# EAGLE design Sunflower_Rev1-3 (EAGLE 7.2.0)

## Sheet 1 of 3
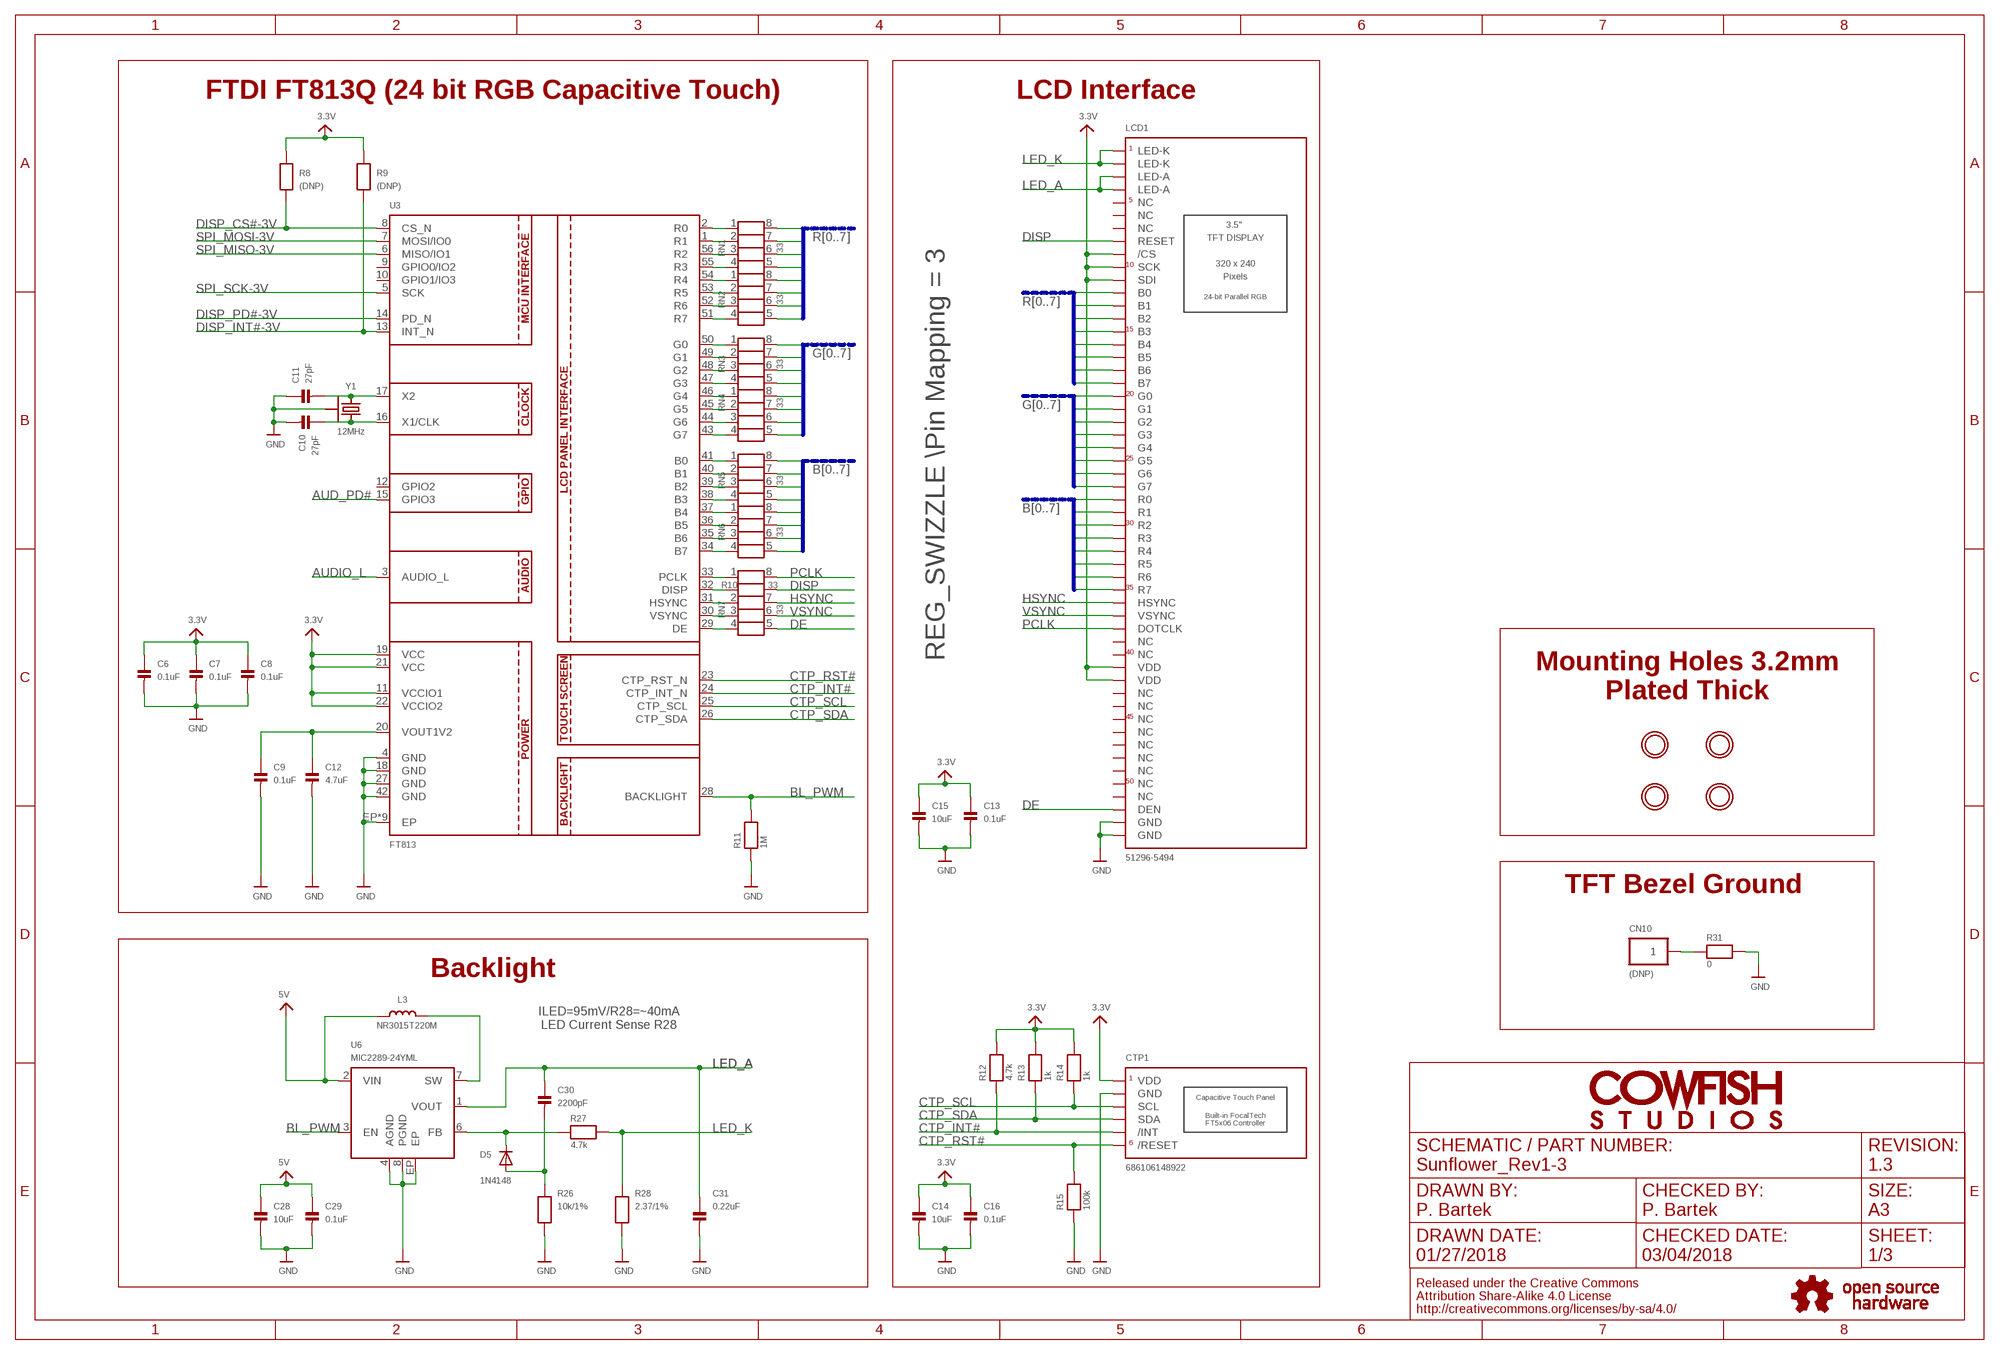
[diagram p0: schematic, sheet 1]

### Parts
C6  0.1uF  CAP_CERAMIC0603  [0603]
C7  0.1uF  CAP_CERAMIC0603  [0603]
C8  0.1uF  CAP_CERAMIC0603  [0603]
C9  0.1uF  CAP_CERAMIC0603  [0603]
C10  27pF  CAP_CERAMIC0603  [0603]
C11  27pF  CAP_CERAMIC0603  [0603]
C12  4.7uF  CAP_CERAMIC0603  [0603]
C13  0.1uF  CAP_CERAMIC0603  [0603]
C14  10uF  CAP_CERAMIC0603  [0603]
C15  10uF  CAP_CERAMIC0603  [0603]
C16  0.1uF  CAP_CERAMIC0603  [0603]
C28  10uF  CAP_CERAMIC0603  [0603]
C29  0.1uF  CAP_CERAMIC0603  [0603]
C30  2200pF  CAP_CERAMIC0603  [0603]
C31  0.22uF  CAP_CERAMIC0603  [0603]
CN10  (DNP)  RFI_SHIELD_FINGER  [S7081-42R]
CTP1  686106148922  CTPT4  [FPC_686106148922]
D5  1N4148  DIODESOD-323  [SOD-323]
H1  MOUNTINGHOLE3.2  [MOUNTINGHOLE_3.2_PLATED]
H2  MOUNTINGHOLE3.2  [MOUNTINGHOLE_3.2_PLATED]
H3  MOUNTINGHOLE3.2  [MOUNTINGHOLE_3.2_PLATED]
H4  MOUNTINGHOLE3.2  [MOUNTINGHOLE_3.2_PLATED]
L3  NR3015T220M  INDUCTOR  [INDUCTOR_3X3MM_TY_NR]
LCD1  51296-5494  TFT_NHD-3.5-320240MF-ASXNT1  [FPC_51296_5494]
R8  (DNP)  RESISTOR0603  [0603]
R9  (DNP)  RESISTOR0603  [0603]
R10  33  RESISTOR0603  [0603]
R11  1M  RESISTOR0603  [0603]
R12  4.7k  RESISTOR0603  [0603]
R13  1k  RESISTOR0603  [0603]
R14  1k  RESISTOR0603  [0603]
R15  100k  RESISTOR0603  [0603]
R26  10k/1%  RESISTOR0603  [0603]
R27  4.7k  RESISTOR0603  [0603]
R28  2.37/1%  RESISTOR0805  [0805]
R31  0  RESISTOR0603  [0603]
RN1  33  741-8_S  [741-8]
RN2  33  741-8_S  [741-8]
RN3  33  741-8_S  [741-8]
RN4  33  741-8_S  [741-8]
RN5  33  741-8_S  [741-8]
RN6  33  741-8_S  [741-8]
RN7  33  741-8_S  [741-8]
U3  FT813  [VQFN-56PIN]
U6  MIC2289-24YML  MIC2289  [MLF-8PIN]
Y1  12MHz  CRYSTALTHIN  [CRYSTAL_3.2X2.5]

### Nets
3.3V: C6.1 C7.1 C8.1 C13.1 C14.1 C15.1 C16.1 CTP1.1(VDD) LCD1.P$9(/CS) LCD1.P$10(SCK) LCD1.P$11(SDI) LCD1.P$41(VDD) LCD1.P$42(VDD) R8.2 R9.2 R12.2 R13.2 R14.2 U3.11(VCCIO1) U3.19(VCC) U3.21(VCC) U3.22(VCCIO2) ; also sheet 2
5V: C28.1 C29.1 L3.P$1 U6.2(VIN) ; also sheet 2,3
AUD_PD#: U3.15(GPIO3) ; also sheet 3
AUDIO_L: U3.3(AUDIO_L) ; also sheet 3
B0: LCD1.P$28(R0) RN5.8
B1: LCD1.P$29(R1) RN5.7
B2: LCD1.P$30(R2) RN5.6
B3: LCD1.P$31(R3) RN5.5
B4: LCD1.P$32(R4) RN6.8
B5: LCD1.P$33(R5) RN6.7
B6: LCD1.P$34(R6) RN6.6
B7: LCD1.P$35(R7) RN6.5
BL_PWM: R11.2 U3.28(BACKLIGHT) U6.3(EN)
CTP_INT#: CTP1.5(/INT) R12.1 U3.24(CTP_INT_N)
CTP_RST#: CTP1.6(/RESET) R15.2 U3.23(CTP_RST_N)
CTP_SCL: CTP1.3(SCL) R14.1 U3.25(CTP_SCL)
CTP_SDA: CTP1.4(SDA) R13.1 U3.26(CTP_SDA)
DE: LCD1.P$52(DEN) RN7.5
DISP: LCD1.P$8(RESET) R10.2
DISP_CS#-3V: R8.1 U3.8(CS_N) ; also sheet 2
DISP_INT#-3V: R9.1 U3.13(INT_N) ; also sheet 2
DISP_PD#-3V: U3.14(PD_N) ; also sheet 2
G0: LCD1.P$20(G0) RN3.8
G1: LCD1.P$21(G1) RN3.7
G2: LCD1.P$22(G2) RN3.6
G3: LCD1.P$23(G3) RN3.5
G4: LCD1.P$24(G4) RN4.8
G5: LCD1.P$25(G5) RN4.7
G6: LCD1.P$26(G6) RN4.6
G7: LCD1.P$27(G7) RN4.5
GND: C6.2 C7.2 C8.2 C9.2 C10.2 C11.1 C12.2 C13.2 C14.2 C15.2 C16.2 C28.2 C29.2 C31.2 CTP1.2(GND) CTP1.SUPPORT1(GND) CTP1.SUPPORT2(GND) LCD1.P$53(GND) LCD1.P$54(GND) LCD1.SUPPORT1(GND) LCD1.SUPPORT2(GND) R11.1 R15.1 R26.1 R28.1 R31.2 U3.4(GND) U3.18(GND) U3.27(GND) U3.42(GND) U3.EP U3.TV@1(EP) U3.TV@2(EP) U3.TV@3(EP) U3.TV@4(EP) U3.TV@5(EP) U3.TV@6(EP) U3.TV@7(EP) U3.TV@8(EP) U6.4(AGND) U6.8(PGND) U6.EP Y1.GND1 Y1.GND2 ; also sheet 2,3
HSYNC: LCD1.P$36(HSYNC) RN7.7
LED_A: C30.1 C31.1 LCD1.P$3(LED-A) LCD1.P$4(LED-A) U6.1(VOUT)
LED_K: LCD1.P$1(LED-K) LCD1.P$2(LED-K) R27.2 R28.2
N$1: RN1.1 U3.2(R0)
N$2: RN1.2 U3.1(R1)
N$3: RN1.3 U3.56(R2)
N$4: RN1.4 U3.55(R3)
N$5: RN2.1 U3.54(R4)
N$6: RN2.2 U3.53(R5)
N$7: RN2.3 U3.52(R6)
N$8: RN2.4 U3.51(R7)
N$9: RN3.1 U3.50(G0)
N$10: RN3.2 U3.49(G1)
N$11: RN3.3 U3.48(G2)
N$12: RN3.4 U3.47(G3)
N$13: RN4.1 U3.46(G4)
N$14: RN4.2 U3.45(G5)
N$15: RN4.3 U3.44(G6)
N$16: RN4.4 U3.43(G7)
N$17: RN5.1 U3.41(B0)
N$18: RN5.2 U3.40(B1)
N$19: RN5.3 U3.39(B2)
N$20: RN5.4 U3.38(B3)
N$21: RN6.1 U3.37(B4)
N$22: RN6.2 U3.36(B5)
N$23: RN6.3 U3.35(B6)
N$24: RN6.4 U3.34(B7)
N$25: RN7.1 U3.33(PCLK)
N$26: RN7.2 U3.31(HSYNC)
N$27: RN7.3 U3.30(VSYNC)
N$28: RN7.4 U3.29(DE)
N$29: CN10.P$1 R31.1
N$33: C11.2 U3.17(X2) Y1.2
N$34: C9.1 C12.1 U3.20(VOUT1V2)
N$35: C10.1 U3.16(X1/CLK) Y1.1
N$36: L3.P$2 U6.7(SW)
N$37: D5.C R27.1 U6.6(FB)
N$38: C30.2 D5.A R26.2
N$59: R10.1 U3.32(DISP)
PCLK: LCD1.P$38(DOTCLK) RN7.8
R0: LCD1.P$12(B0) RN1.8
R1: LCD1.P$13(B1) RN1.7
R2: LCD1.P$14(B2) RN1.6
R3: LCD1.P$15(B3) RN1.5
R4: LCD1.P$16(B4) RN2.8
R5: LCD1.P$17(B5) RN2.7
R6: LCD1.P$18(B6) RN2.6
R7: LCD1.P$19(B7) RN2.5
SPI_MISO-3V: U3.6(MISO/IO1) ; also sheet 2
SPI_MOSI-3V: U3.7(MOSI/IO0) ; also sheet 2
SPI_SCK-3V: U3.5(SCK) ; also sheet 2
VSYNC: LCD1.P$37(VSYNC) RN7.6
Unconnected: LCD1.P$5(NC) LCD1.P$6(NC) LCD1.P$7(NC) LCD1.P$39(NC) LCD1.P$40(NC) LCD1.P$43(NC) LCD1.P$44(NC) LCD1.P$45(NC) LCD1.P$46(NC) LCD1.P$47(NC) LCD1.P$48(NC) LCD1.P$49(NC) LCD1.P$50\(NC) LCD1.P$51(NC) U3.9(GPIO0/IO2) U3.10(GPIO1/IO3) U3.12(GPIO2)

### Buses
B[0..7]
G[0..7]
R[0..7]

### Notes on the sheet
- FTDI FT813Q (24 bit RGB Capacitive Touch) | LCD Interface
- RN1 | 33
- RN2 | 33
- RN3 | 33
- RN4 | 33
- RN5 | 33
- RN6 | 33
- RN7 | 33
- REG_SWIZZLE \Pin Mapping = 3
- Mounting Holes 3.2mm
  Plated Thick
- TFT Bezel Ground
- Backlight
- ILED=95mV/R28=~40mA
  LED Current Sense R28
- 1.3
- P. Bartek
- 01/27/2018 | 03/04/2018

## Sheet 2 of 3
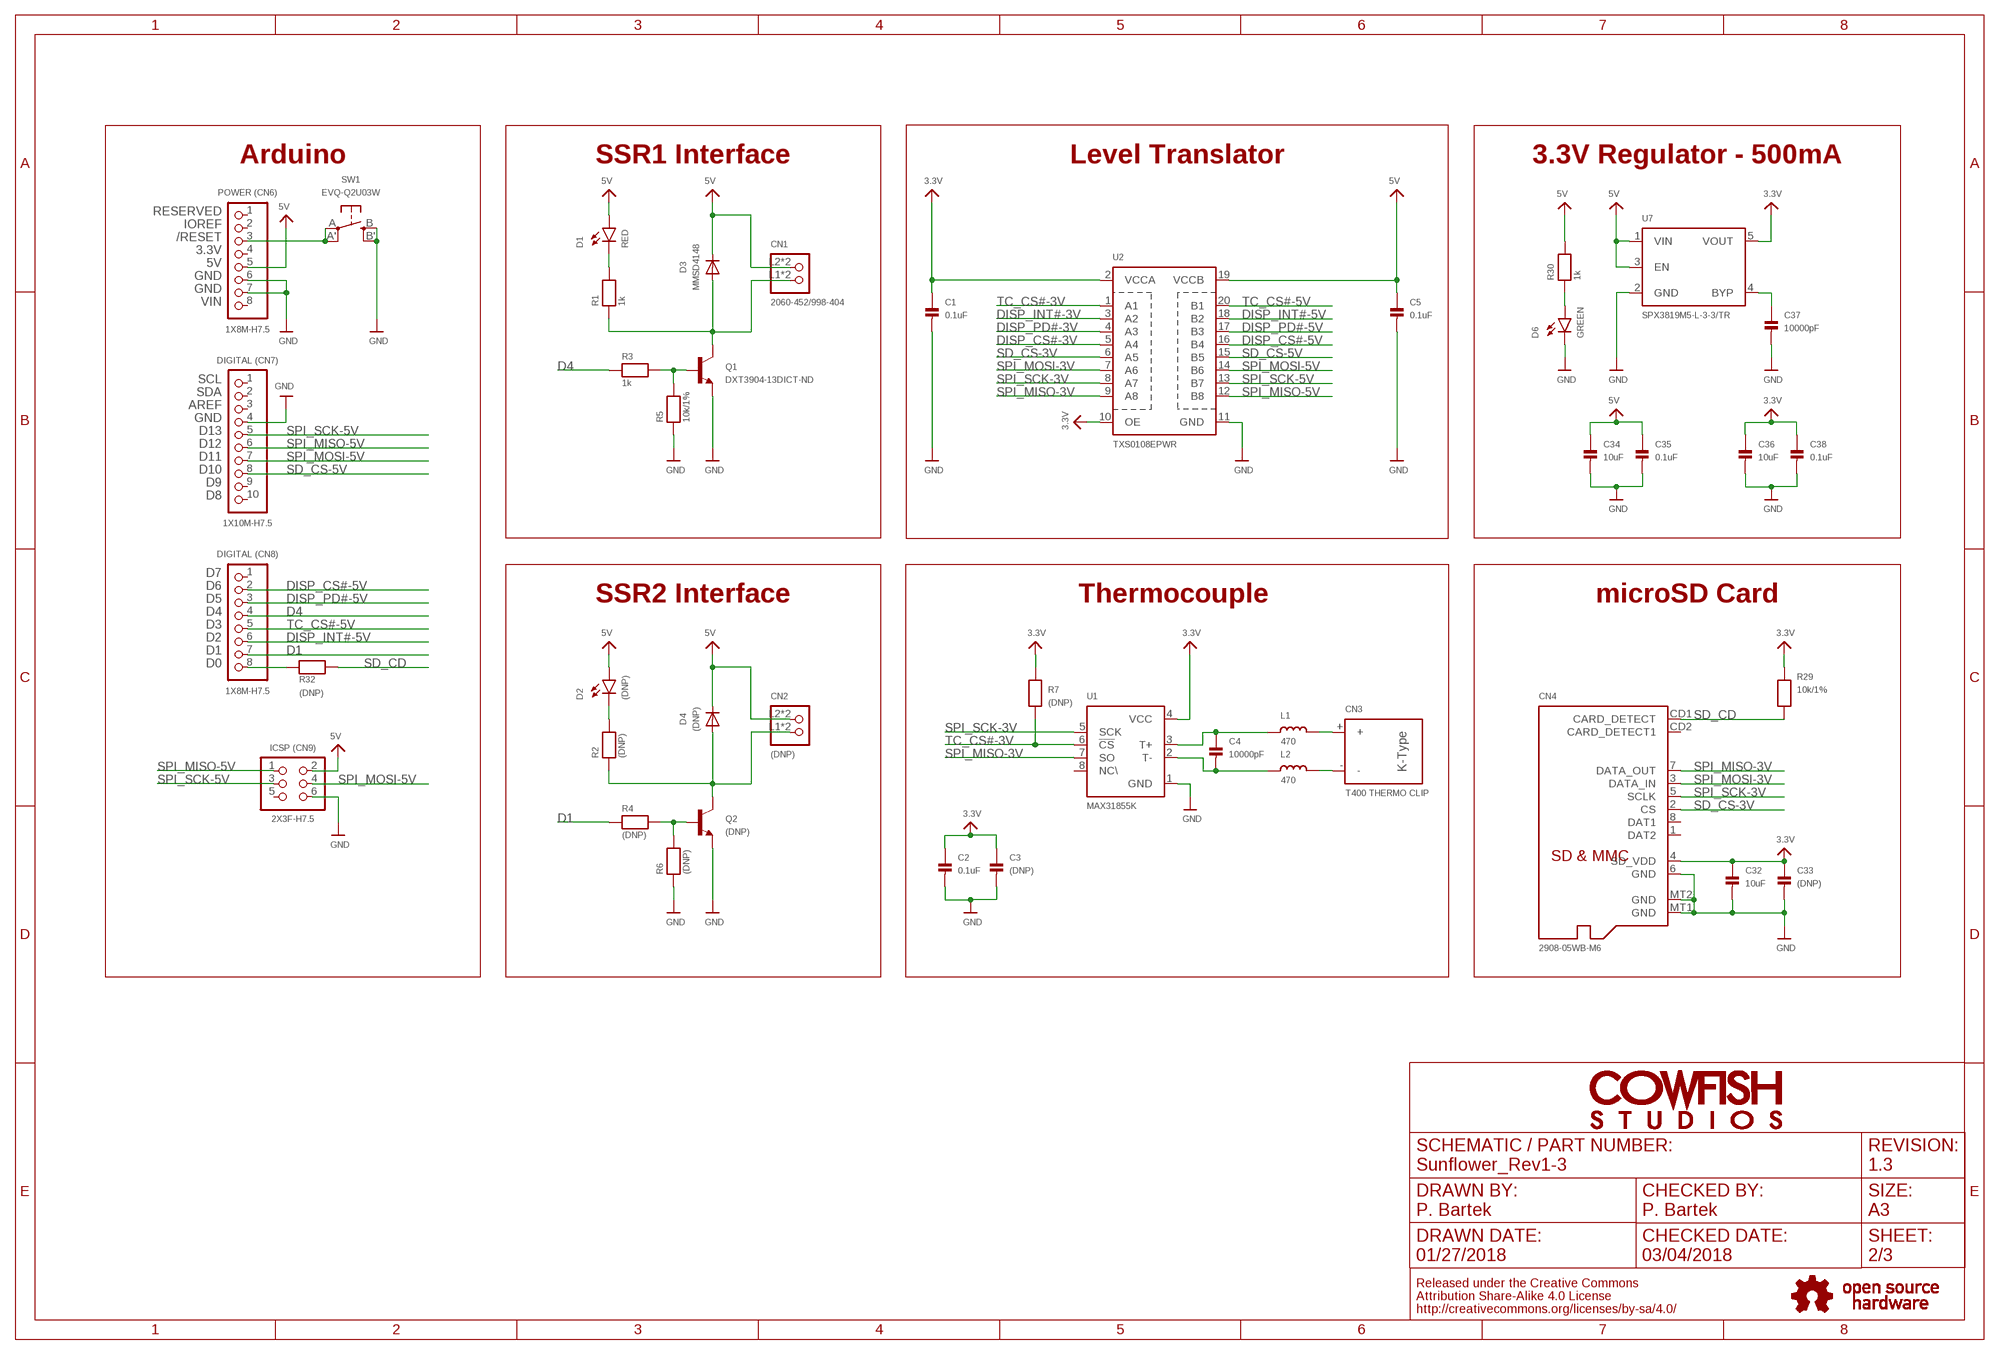
[diagram p1: schematic, sheet 2]

### Parts
C1  0.1uF  CAP_CERAMIC0603  [0603]
C2  0.1uF  CAP_CERAMIC0603  [0603]
C3  (DNP)  CAP_CERAMIC0603  [0603]
C4  10000pF  CAP_CERAMIC0603  [0603]
C5  0.1uF  CAP_CERAMIC0603  [0603]
C32  10uF  CAP_CERAMIC0603  [0603]
C33  (DNP)  CAP_CERAMIC0603  [0603]
C34  10uF  CAP_CERAMIC0603  [0603]
C35  0.1uF  CAP_CERAMIC0603  [0603]
C36  10uF  CAP_CERAMIC0603  [0603]
C37  10000pF  CAP_CERAMIC0603  [0603]
C38  0.1uF  CAP_CERAMIC0603  [0603]
CN1  2060-452/998-404  [P-2060-452/998-404]
CN2  (DNP)  2060-452/998-404  [P-2060-452/998-404]
CN3  T400 THERMO CLIP  THERMOCOUPLE_MINI_PAX_INSIDE  [THERMOCOUPLE_CLIP_INSIDE]
CN4  2908-05WB-M6  MICROSD  [MICROSD]
CN6  1X8M-H7.5  PINHD-1X08SMT_T1  [1X08_SMD_M_LEYCONN]
CN7  1X10M-H7.5  PINHD-1X10SMT_T1  [1X10_SMD_M_LEYCONN]
CN8  1X8M-H7.5  PINHD-1X08SMT_T1  [1X08_SMD_M_LEYCONN]
CN9  2X3F-H7.5  PINHD-2X03SMT_T2  [2X3_SMD_F_LEYCONN]
D1  RED  LED-BLUE0603  [LED-0603]
D2  (DNP)  LED-BLUE0603  [LED-0603]
D3  MMSD4148  DIODESOD-123  [SOD-123]
D4  (DNP)  DIODESOD-123  [SOD-123]
D6  GREEN  LED-BLUE0603  [LED-0603]
L1  470  INDUCTOR0603  [0603]
L2  470  INDUCTOR0603  [0603]
Q1  DXT3904-13DICT-ND  DXT3904-13  [SOT-89-3]
Q2  (DNP)  DXT3904-13  [SOT-89-3]
R1  1k  RESISTOR0603  [0603]
R2  (DNP)  RESISTOR0603  [0603]
R3  1k  RESISTOR0603  [0603]
R4  (DNP)  RESISTOR0603  [0603]
R5  10k/1%  RESISTOR0603  [0603]
R6  (DNP)  RESISTOR0603  [0603]
R7  (DNP)  RESISTOR0603  [0603]
R29  10k/1%  RESISTOR0603  [0603]
R30  1k  RESISTOR0603  [0603]
R32  (DNP)  RESISTOR0603  [0603]
SW1  EVQ-Q2U03W  SPST_TACT-EVQQ2  [EVQ-Q2]
U1  MAX31855K  [SOIC8]
U2  TXS0108EPWR  TXS0108ETSSOP  [TSSOP-20PIN]
U7  SPX3819M5-L-3-3/TR  SPX3819  [SOT23-5PIN]

### Nets
3.3V: C1.1 C2.1 C3.1 C32.1 C33.1 C36.1 C38.1 CN4.4(SD_VDD) R7.2 R29.2 U1.4(VCC) U2.2(VCCA) U2.10(OE) U7.5(VOUT) ; also sheet 1
5V: C5.1 C34.1 C35.1 CN1.L2(P1.1) CN1.L2.2(P1.1) CN2.L2(P1.1) CN2.L2.2(P1.1) CN6.5 CN9.2 D1.A D2.A D3.C D4.C R30.2 U2.19(VCCB) U7.1(VIN) U7.3(EN) ; also sheet 1,3
D1: CN8.7 R4.1
D4: CN8.4 R3.1
DISP_CS#-3V: U2.5(A4) ; also sheet 1
DISP_CS#-5V: CN8.2 U2.16(B4)
DISP_INT#-3V: U2.3(A2) ; also sheet 1
DISP_INT#-5V: CN8.6 U2.18(B2)
DISP_PD#-3V: U2.4(A3) ; also sheet 1
DISP_PD#-5V: CN8.3 U2.17(B3)
GND: C1.2 C2.2 C3.2 C5.2 C32.2 C33.2 C34.2 C35.2 C36.2 C37.2 C38.2 CN4.6(GND) CN4.MT1(GND) CN4.MT2(GND) CN6.6 CN6.7 CN7.4 CN9.6 D6.C Q1.E Q2.E R5.1 R6.1 SW1.B'(S1) SW1.B(S) U1.1(GND) U2.11(GND) U7.2(GND) ; also sheet 1,3
N$30: D6.A R30.1
N$39: C4.1 L1.1 U1.3(T+)
N$40: C4.2 L2.1 U1.2(T-)
N$41: CN3.+ L1.2
N$42: CN3.- L2.2
N$43: C37.1 U7.4(BYP)
N$45: Q1.B R3.2 R5.2
N$47: Q2.B R4.2 R6.2
N$48: CN1.L1(P2.1) CN1.L1.2(P2.1) D3.A Q1.C Q1.C@1(C) R1.1
N$49: D1.C R1.2
N$50: CN8.8 R32.1
N$51: D2.C R2.2
N$53: CN2.L1(P2.1) CN2.L1.2(P2.1) D4.A Q2.C Q2.C@1(C) R2.1
N$58: CN6.3 SW1.A'(P1) SW1.A(P)
SD_CD: CN4.CD1(CARD_DETECT) R29.1 R32.2
SD_CS-3V: CN4.2(CS) U2.6(A5)
SD_CS-5V: CN7.8 U2.15(B5)
SPI_MISO-3V: CN4.7(DATA_OUT) U1.7(SO) U2.9(A8) ; also sheet 1
SPI_MISO-5V: CN7.6 CN9.1 U2.12(B8)
SPI_MOSI-3V: CN4.3(DATA_IN) U2.7(A6) ; also sheet 1
SPI_MOSI-5V: CN7.7 CN9.4 U2.14(B6)
SPI_SCK-3V: CN4.5(SCLK) U1.5(SCK) U2.8(A7) ; also sheet 1
SPI_SCK-5V: CN7.5 CN9.3 U2.13(B7)
TC_CS#-3V: R7.1 U1.6(!CS) U2.1(A1)
TC_CS#-5V: CN8.5 U2.20(B1)
Unconnected: CN4.1(DAT2) CN4.8(DAT1) CN4.CD2(CARD_DETECT1) CN6.1 CN6.2 CN6.4 CN6.8 CN7.1 CN7.2 CN7.3 CN7.9 CN7.10 CN8.1 CN9.5 U1.8(NC\)

### Notes on the sheet
- Arduino | SSR1 Interface | Level Translator | 3.3V Regulator - 500mA
- POWER (CN6)
- RESERVED
- IOREF
- /RESET
- 3.3V
- 5V
- GND
- GND
- VIN
- DIGITAL (CN7)
- SCL
- SDA
- AREF
- GND
- D13
- D12
- D11
- D10
- D9
- D8
- DIGITAL (CN8)
- D7
- D6
- D5 | SSR2 Interface | Thermocouple | microSD Card
- D4
- D3
- D2
- D1
- D0
- ICSP (CN9)
- 1.3
- P. Bartek
- 01/27/2018 | 03/04/2018

## Sheet 3 of 3
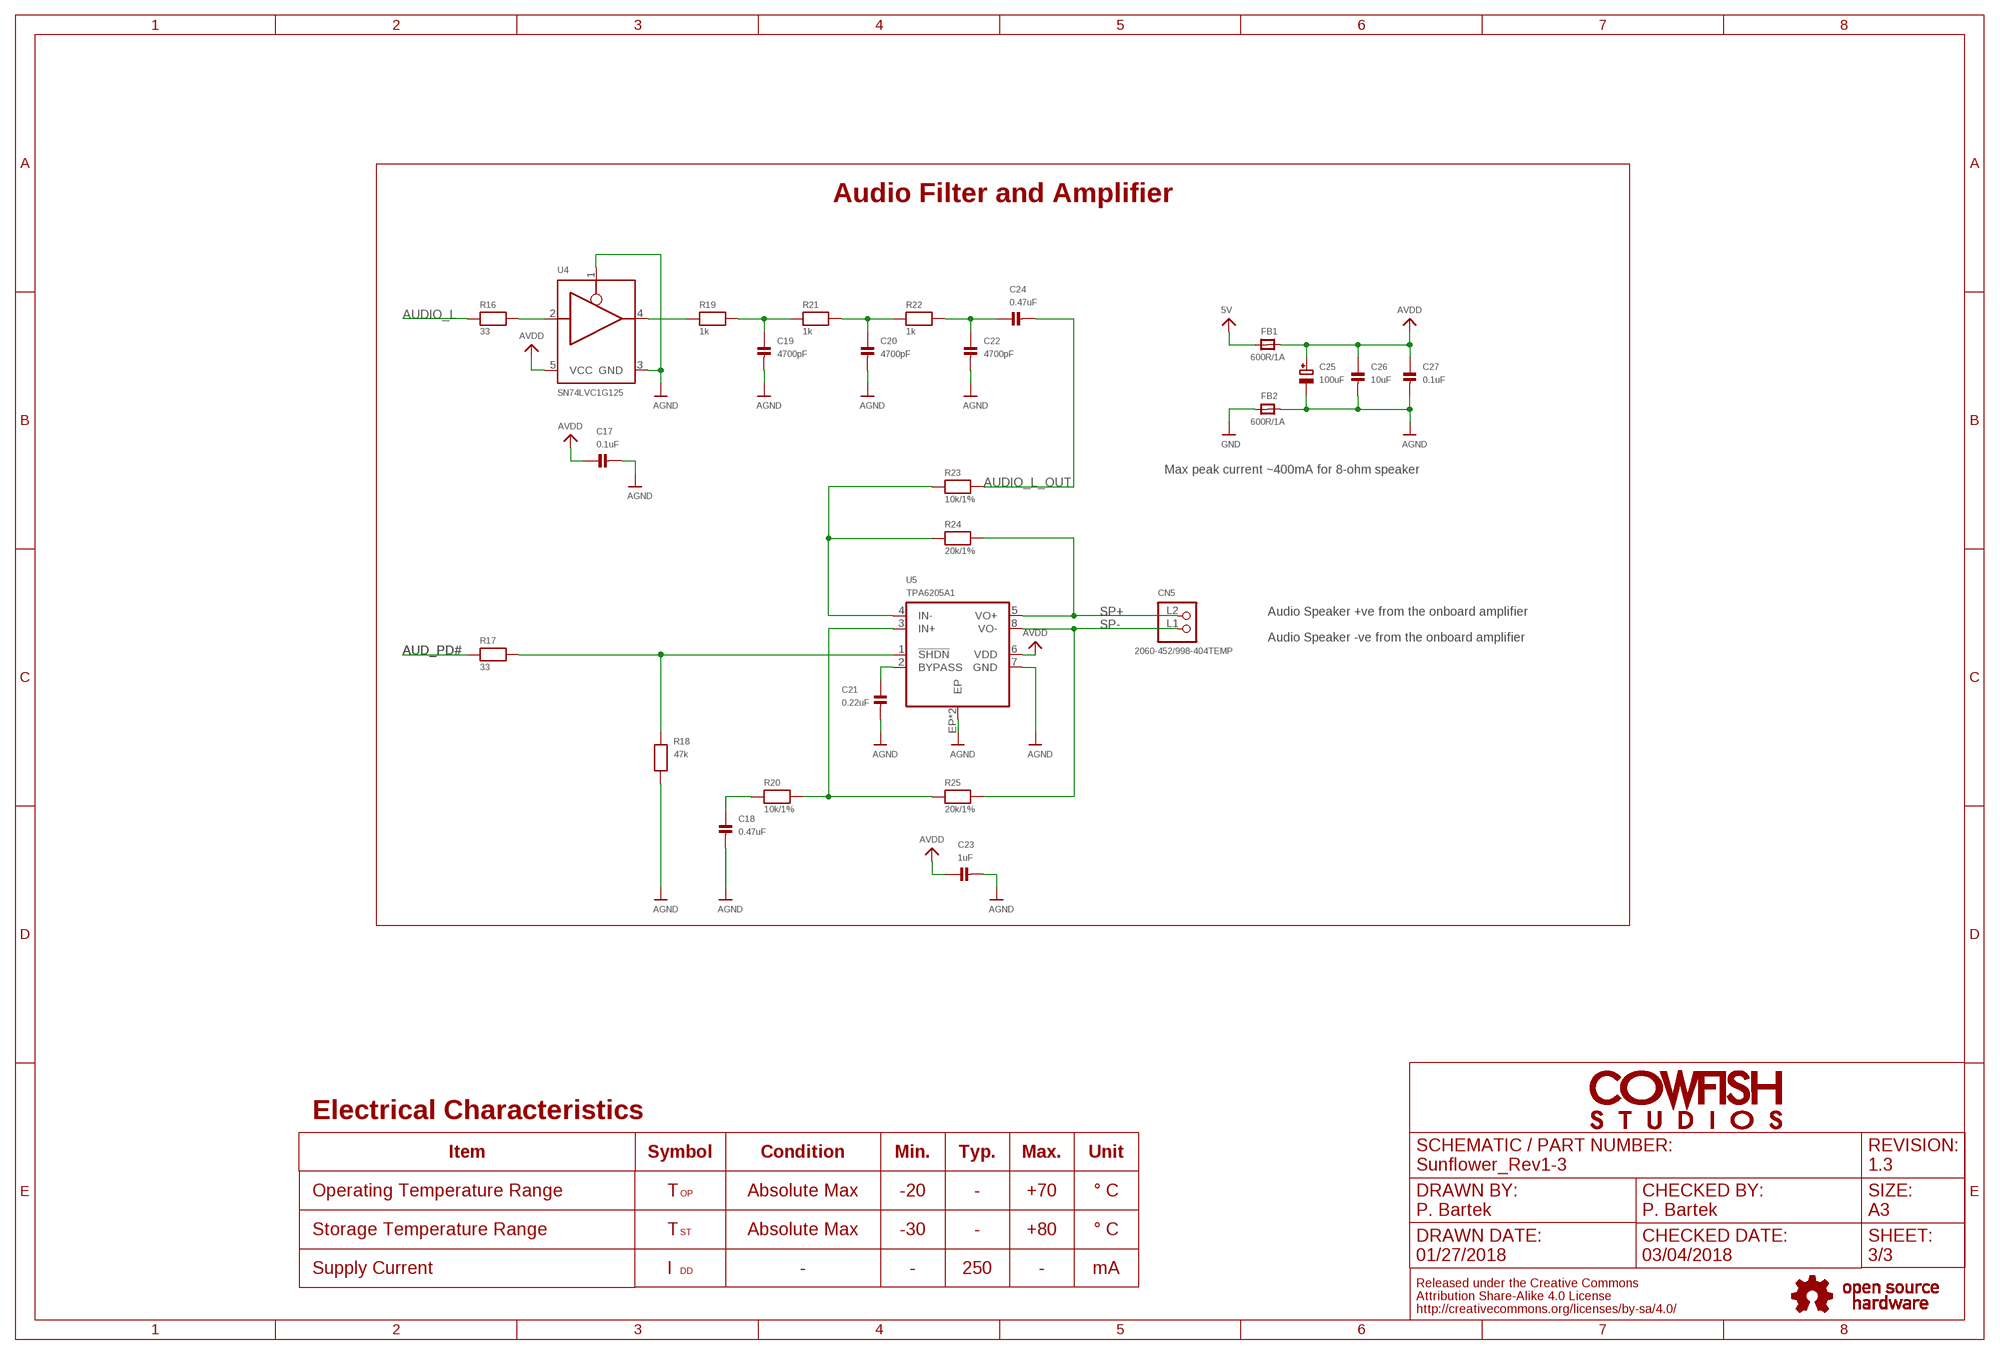
[diagram p2: schematic, sheet 3]

### Parts
C17  0.1uF  CAP_CERAMIC0603  [0603]
C18  0.47uF  CAP_CERAMIC0603  [0603]
C19  4700pF  CAP_CERAMIC0603  [0603]
C20  4700pF  CAP_CERAMIC0603  [0603]
C21  0.22uF  CAP_CERAMIC0805  [0805]
C22  4700pF  CAP_CERAMIC0603  [0603]
C23  1uF  CAP_CERAMIC0603  [0603]
C24  0.47uF  CAP_CERAMIC0603  [0603]
C25  100uF  CAP_TANTALUMA/3216_REFLOW  [EIA3216-18/A-R]
C26  10uF  CAP_CERAMIC0603  [0603]
C27  0.1uF  CAP_CERAMIC0603  [0603]
CN5  2060-452/998-404TEMP  [P-2060-452/998-404]
FB1  600R/1A  FERRITE0805  [0805]
FB2  600R/1A  FERRITE0805  [0805]
R16  33  RESISTOR0603  [0603]
R17  33  RESISTOR0603  [0603]
R18  47k  RESISTOR0603  [0603]
R19  1k  RESISTOR0603  [0603]
R20  10k/1%  RESISTOR0603  [0603]
R21  1k  RESISTOR0603  [0603]
R22  1k  RESISTOR0603  [0603]
R23  10k/1%  RESISTOR0603  [0603]
R24  20k/1%  RESISTOR0603  [0603]
R25  20k/1%  RESISTOR0603  [0603]
U4  SN74LVC1G125  [SOT23-5PIN]
U5  TPA6205A1  [MSOP-8PIN]

### Nets
5V: FB1.1 ; also sheet 1,2
AGND: C17.2 C18.2 C19.2 C20.2 C21.2 C22.2 C23.2 C25.- C26.2 C27.2 FB2.2 R18.1 U4.1(OE) U4.3(GND) U5.7(GND) U5.EP U5.TV(EP)
AUD_PD#: R17.1 ; also sheet 1
AUDIO_L: R16.1 ; also sheet 1
AUDIO_L_OUT: C24.2 R23.2
AVDD: C17.1 C23.1 C25.+ C26.1 C27.1 FB1.2 U4.5(VCC) U5.6(VDD)
GND: FB2.1 ; also sheet 1,2
N$32: R16.2 U4.2(I)
N$52: R17.2 R18.2 U5.1(!SHDN)
N$54: R19.1 U4.4(O)
N$55: C19.1 R19.2 R21.1
N$57: C20.1 R21.2 R22.1
N$60: C21.1 U5.2(BYPASS)
N$61: C22.1 C24.1 R22.2
N$65: R20.2 R25.1 U5.3(IN+)
N$66: C18.1 R20.1
N$71: R23.1 R24.1 U5.4(IN-)
SP+: CN5.L2(P1.1) R24.2 U5.5(VO+)
SP-: CN5.L1(P2.1) R25.2 U5.8(VO-)

### Notes on the sheet
- Audio Filter and Amplifier
- Max peak current ~400mA for 8-ohm speaker
- Audio Speaker +ve from the onboard amplifier
- Audio Speaker -ve from the onboard amplifier
- Electrical Characteristics
- Item | Symbol | Condition | Min. | Typ. | Max. | Unit
- 1.3
- Operating Temperature Range | T | OP | Absolute Max | -20 | - | +70 | ° C
- P. Bartek
- Storage Temperature Range | T | ST | Absolute Max | -30 | - | +80 | ° C
- 01/27/2018 | 03/04/2018
- Supply Current | I | DD | - | - | 250 | - | mA

## Library data of the parts
C1-C24 C26-C38 = microbuilder:CAP_CERAMIC: Ceramic Capacitors 0402 - 0402 Surface Mount Capacitors 16pF 50V 5% [Digikey: 445-4899-2-ND] 18pF 50V 5% [Digikey: 490-1281-2-ND] 22pF 50V 5% [Digikey: 490-1283-2-ND] 68pF 50V 5% [Digikey: 490-1289-2-ND] 0.1uF 10V 10% [Digikey: 490-1318-2-ND] 1.0uF 6.3V 10% [Digikey: 490-1320-2-ND] 0603 - 0603 Surface Mount Capacitors 16 pF 50V 5% [Digikey: 445-5051-2-ND] 22 pF 50V [Digikey: PCC220ACVTR-ND] 33 pF 50V 5% [Digikey: 490-1415-1-ND] 56pF 50V 5% [Digikey: 490-1421-1-ND] 220pF 50V 5% [Digikey: 445-1285-1-ND] 680 pF 50V 2200 pF 50V 5% C0G [Digikey: 445-1297-1-ND] 5600 pF 100V 5% X7R [Digikey: 478-3711-1-ND] 0.1 µF 25V 10% [Digikey: PCC2277TR-ND] 0.22 µF 16V 10% X7R [Digikey: 445-1318-1-ND] 1.0 µF 25V 10% [Digikey: 445-5146-2-ND] 0603 - RF Specific 3pF 250V +/-0.1pF RF [Digikey: 712-1347-1-ND] 18 pF 250V 5% [Digikey: 478-3505-1-ND or 712-1322-1-ND] 56 pF 250V 5% C0G RF [Digikey: 490-4867-1-ND] 68 pF 250V RF [Digikey: 490-4868-1-ND] 0805 - 0805 Surface Mount Capacitors 220 pF 250V 2% RF Ceramic Capacitor [Digikey: 712-1398-1-ND] 1000 pF 50V 2% NP0 Ceramic Capacitor [Digikey: 478-3760-1-ND] 0.1 µF 25V 10% Ceramic Capacitor [Digikey: PCC1828TR-ND] 1.0 µF 16V 10% Ceramic Capacitor[Digikey: 490-1691-2-ND] 10.0 µF 10V 10% Ceramic Capacitor[Digikey: 709-1228-1-ND] 10.0 uF 16V 10% Ceramic Capacitor [Digikey: 478-5165-2-ND] 47 uF 6.3V 20% Ceramic Capacitor [Digikey: 587-1779-1-ND or 399-5506-1-ND] 1206 - 1206 Surface Mount Capacitors 47uF 10V 20% Ceramic Capacitor [Digikey: 490-5528-1-ND or 399-5508-1-ND or 445-6010-1-ND] 100uF 6.3V -20%, +80% Y5V Ceramic Capacitor (Digikey: 490-4512-1-ND, Mouser: 81-GRM31CF50J107ZE1L)
C25 = microbuilder:CAP_TANTALUM: Tantalum Capacitors Wave footprints have larger pads and are meant to be used for hand soldering. Reflow footprints are optimised for solder paste and a reflow oven. EIA3216-18/A-[R/W] - Size A / 3216-18 / 1206 footprint 4.7µF 25V 10% Tantalum Capacitor 10µF 16V 10% Tantalum Capacitor [Digikey: 495-2236-2-ND] EIA3528-21/B-[R/W] - Size B / 3528-21 47µF 10V 10% Tantalum Capactior [Digikey: 495-2216-1-ND] EIA6032-28/C-[R/W] - Size C / 6032-28 10µF 35V 20% Tantalum Capacitor [Digikey: 495-2285-1-ND] 100µF 16V 10% Tantalum Capactior [Digikey: 399-5214-1-ND]
CN1 CN2 CN5 = CowFish-Connectors:2060-452/998-404: As of: 01/01/2014. Please find the newest data for this article in our product catalogue, which can be viewed under www.wago.com.
CN3 = CowFish-Connectors:THERMOCOUPLE_MINI_PAX; MF: Pax Instruments; MPN: PI1024 (2x)
CN4 = microbuilder:MICROSD: MicroSD/Transflash Card Holder with SPI pinout 3M: 2908-05WB-MG 4UConnector: 19656 Footprint courtesy: Adafruit Industries
CN6 CN8 = CowFish-Connectors:PINHD-1X08: Pin header 1x08 0.1" spacing
CN7 = CowFish-Connectors:PINHD-1X10: Pin header 1x10 0.1" spacing
CN9 = CowFish-Connectors:PINHD-2X03: Pin header 2x03 0.1" spacing
CN10 = CowFish-Connectors:RFI_SHIELD_FINGER
CTP1 = CowFish-Displays:CTP: Capacitive Touch Panel 6-Pin 1.0mm Pitch FPC Cable (Bottom Contacts)
D1 D2 D6 = SparkFun-LED:LED-BLUE: Blue SMD LED Used in manufacturing of various products at SparkFun Packages: 0603 - SMD 0603 package [Product Link] <http://www.digikey.com/product-detail/en/SMLE12BC7TT86/511-1589-2-ND/1641808> 1206 - SMD1206 package [Product Link] <http://www.digikey.com/product-detail/en/lite-on-inc/LTST-C150TBKT/160-1643-1-ND/573584> SparkFun Products: ESP8266 Thing-Dev Board <https://www.sparkfun.com/products/13711> RedBoard <https://www.sparkfun.com/products/12757>; PROD_ID: DIO-08575; VALUE: BLUE
D3-D5 = microbuilder:DIODE: Diode SMA Model Volts Amps Type Vf Vr Digikey # Notes SSA34-E3 40V 3A Schottky 480mV @ 3A 200uA @ 40V SSA34-E3/61TGITR-ND CDBA120-G 20V 1A Schottky 500mV @ 1A 500uA @ 20V 641-1014-6-ND REEL MBRA210 10V 2A Schottky 350mV @ 2A 700uA @ 10V MBRA210LT3 SOD-123 Model Volts Amps Type Vf Vr Order # Notes BAT54T1G 30V 200mA Schottky 800mV @ 200mA 2uA @ 25V BAT54T1GOSTR-ND B0530W 30V 500mA Schottky 430mV @ 500mA 130uA @ 30V B0530W-FDICT-ND REEL MBR120 1A 20V Schottky 340mV @ 1A MBR120VLSFT1GOSCT-ND SOD-323 Model Volts Amps Type Vf Vr Order # Notes PMEG2005EJ 20V 500mA Schottky 355mV @ 500mA 568-4110-1-ND ZLLS410 10V 570mA Schottky 380mV @ 570mA ZLLS410CT-ND 1N4148WS 75V 150mA Silicon/Simple 1V 1N4148WSFSCT-ND REEL SOD-523 Model Volts Amps Type Vf Vr Order # Notes BAT54XV2 30V 200mA Schottky 0.8V @ 100mA BAT54XV2CT-ND TB751S 30V 30mA Schottky RB751S-40TE61CT-ND SOT23-R/W (R = Solder Paste/Reflow Ovens, W = Hand-Soldering) Model Volts Amps Type Vf Vr Order # Notes BAT54FILM 40V 300mA Schottky 497-7162-1-ND
FB1 FB2 = microbuilder:FERRITE: Ferrite Bead 0603 MMZ1608B121C - 120 Ohm @ 100MHz, 600mA, 0.15 Ohm DC Resistance - Digikey: 445-2164-1-ND BK1608HW121-T - 120 Ohm, 600mA Ferrite Chip - Digikey: 587-1876-2-ND 0805 HZ0805B272R-10 - 2.7K Ohm @ 100MHz, 200mA, 0.8 Ohm DC Resistance - Digikey: 240-2504-1-ND (see also Murata BLM21BD272SN1L) MMZ2012Y152B - 1.5K Ohm @ 100MHz, 500mA, 0.4 Ohm DC Resistance - Digikey: 445-1560-1-ND - Mainly for high frequency (80-400MHz) MMZ2012R102A - 1K Ohm @ 100MHz, 500mA, 0.3 Ohm DC Resistance - Digikey: 445-1555-2-ND - More general purpose (10-200MHz)
H1-H4 = CowFish-Connectors:MOUNTINGHOLE: Mounting Hole
L1 L2 = microbuilder-old:INDUCTOR: Inductors 0603: 10nH Ceramic Inductor - microwire antenna/RF (Digikey: 712-1434-2-ND) 0805: 560nH Ceramic Inductor - RF (Digikey: 553-1047-1-ND) 270nH Ceramic Inductor - Q = 40@250MHz, +-5%, 1 Ohm DC Resistance (Digikey: 535-10506-2-ND) 1007 (2518 Metric) SMT: 10µH 10% 250mOhm 820mA 1007 Inductor (Digikey: 587-2189-1-ND) 22µH 10% 500mOhm 580mA 1007 Inductor (Digikey: 587-2190-1-ND) 47µH 10% 950mOhm 420mA 1007 Inductor (Digikey: 587-2191-1-ND) 47µH 5% 100mOhm 1A 1008 Inductor (Digikey: 732-1816-1-ND) 5.0x5.0mm (Taiyo Yuden NR5040 Series) 6.8µH 20% 2.3A 64mOhm Inductor (Digikey: 587-2374-2-ND) 5.0x5.0mm (TDK VLC5045 Series) 4.7µH 20% 3.3A 34mOhm Inductor (Digikey: 445-6526-1-ND) 6.8µH 20% 2.7A 46mOhm Inductor (Digikey: 445-6527-1-ND) 6.0x6.0mm (TDK VLC6045 Series) 4.7µH 20% 3.8A 27mOhm Inductor (Digikey: 445-6538-2-ND) 6.8µH 20% 3A 41mOhm Inductor (Digikey: 445-6540-1-ND) 6.2µH 30% 2.2A 45mOhm Inductor (Digikey: SRR5028-6R2YCT-ND) - Not TDK VLC6045 but footprint should match 6.0x6.0mm (TDK SLF6045 Series) 6.8uH 30% 2A 33mOhm Inductor (Digikey: 445-4572-1-ND, Mouser: 810-SLF645T6R8N2R0PF)
L3 = CowFish-Passives:INDUCTOR
LCD1 = CowFish-Displays:TFT_NHD-3.5-320240MF-ASXN: 3.5" 320x240 24-bit Parallel RGB - NHD-3.5-320240MF-ASXN# 54-Pin 0.5mm FPC (Bottom Contact)
Q1 Q2 = CowFish-Passives:DXT3904-13: TRANS NPN 40V 0.2A SOT89-3 Bipolar (BJT) Transistor NPN 40V 200mA 300MHz 1W Surface Mount SOT-89-3 - Digikey: DXT3904-13DICT-ND
R1-R32 = microbuilder:RESISTOR: Resistors 0402 - 0402 Surface Mount Package 22 Ohm 1% 1/16W [Digikey: 311-22.0LRTR-ND] 33 Ohm 5% 1/16W 1.0K 5% 1/16W 1.5K 5% 1/16W 2.0K 1% 1/16W 10.0K 1% 1/16W [Digikey: 311-10.0KLRTR-ND] 10.0K 5% 1/16W [Digikey: RMCF0402JT10K0TR-ND] 12.1K 1% 1/16W [Digikey: 311-22.0LRTR-ND] 100.0K 5% 1/16W 0603 - 0603 Surface Mount Package 0 Ohm 1/10 Watt 1% Resistor 15 Ohm 1/10 Watt 1% Resistor 33 Ohm 1/10 Watt 1% Resistor 49.9 Ohm 1/10 Watt 1% Resistor 100 Ohm 1/10 Watt 1% Resistor 150 Ohm 1/10 Watt 1% Resistor 240 Ohm 1/10 Watt 1% Resistor 390 Ohm 1/10 Watt 1% Resistor 560 Ohm 1/10 Watt 1% Resistor 680 Ohm 1/10 Watt 1% Resistor 750 Ohm 1/10 Watt 1% Resistor 1.0K Ohm 1/10 Watt 1% Resistor 1.5K Ohm 1/10 Watt 1% Resistor 2.0K Ohm 1/10 Watt 1% Resistor 2.2K Ohm 1/10 Watt 1% Resistor 3.3K Ohm 1/10 Watt 1% Resistor 4.7K Ohm 1/10 Watt 1% Resistor 10.0K Ohm 1/10 Watt 1% Resistor 12.0K Ohm 1/10 Watt 1% Resistor 12.1K Ohm 1/10 Watt 1% Resistor 20.0K Ohm 1/10 Watt 1% Resistor 33.0K Ohm 1/10 Watt 1% Resistor 100.0K Ohm 1/10 Watt 1% Resistor 0805 - 0805 Surface Mount Package 0 Ohm 1/8 Watt 1% Resistor 33 Ohm 1/8 Watt 1% Resistor 100 Ohm 1/8 Watt 1% Resistor 150 Ohm 1/8 Watt 1% Resistor 200 Ohm 1/8 Watt 1% Resistor 240 Ohm 1/8 Watt 1% Resistor 330 Ohm 1/8 Watt 1% Resistor 390 Ohm 1/8 Watt 1% Resistor 470 Ohm 1/8 Watt 1% Resistor 1.0K Ohm 1/8 Watt 1% Resistor 1.5K Ohm 1/8 Watt 1% Resistor 2.0K Ohm 1/8 Watt 1% Resistor 4.7K Ohm 1/8 Watt 1% Resistor 5.1K Ohm 1/8 Watt 1% Resistor 5.6K Ohm 1/8 Watt 1% Resistor 10.0K Ohm 1/8 Watt 1% Resistor 22.0K Ohm 1/8 Watt 1% Resistor 33.0K Ohm 1/8 Watt 1% Resistor 100K Ohm 1/8 Watt 1% Resistor 1206 - 1206 Surface Mount Package 2012 - 2010 Surface Mount Package 0.11 Ohm 1/2 Watt 1% Resistor - Digikey: RHM.11UCT-ND
RN1-RN7 = CowFish-Passives:741-8_S: CTS 741 Series 8 Terminations, 4 Resistors
SW1 = CowFish-Switches:SPST_TACT: SMT 6mm switch, EVQQ2 series
U1 = CowFish-IC:MAX31855K: Cold-Junction-Compensated K-Thermocoupleto-Digital Converter (-270°C to +1800°C) The MAX31855K performs cold-junction compensation and digitizes the signal from a type-K thermocouple. The data is output in a 14-bit resolution, SPI™-compatible, read-only format. This converter resolves temperatures to 0.25°C, allows readings as high as +1800°C and as low as -270°C, and exhibits thermocouple accuracy of ±2°C for temperatures ranging from -200°C to +700°C for K-type thermocouples.
U2 = CowFish-IC:TXS0108E: TXS0108E - IC Voltage Level Translator Bidirectional 1 Circuit 8 Channel 60Mbps Digikey: 296-24806-1-ND - 20-VQFN Digikey: 296-23011-1-ND - 20-TSSOP
U3 = CowFish-IC:FT813: FT813Q - IC TFT LCD CONTROLLER 56VQFN
U4 = CowFish-IC:SN74LVC1G125: SN74LVC1G125 - IC BUS BUFF TRI-ST N-INV SC705 Digikey: 296-11604-1-ND
U5 = CowFish-IC:TPA6205A1: TPA6205A1 - IC AMP AUDIO PWR 1.25W AB 8MSOP Digikey: 296-21262-1-ND
U6 = CowFish-IC:MIC2289: MIC2289 - IC LED Driver DC DC Regulator Analog, PWM Dimming 750mA (Switch) Backlight 8-MLF (2x2) Digikey: 576-1732-1-ND - 34 output OVP Digikey: 576-1731-1-ND - 24 output OVP
U7 = CowFish-IC:SPX3819: SPX3819 - PMIC - Voltage Regulator SOT-23-5 Digikey: 1016-1873-1-ND
Y1 = microbuilder:CRYSTAL: Crystals HC49UP - Surface Mount Crystal 4.0MHz 18pF +/-30ppm Surface Mount Crystal [Digikey: 535-9857-1-ND] 12.0 MHz Surface Mount Crystal [Digikey: 535-9869-6-ND] 25.0 MHz Surface Mount Crystal [Digikey: 535-9078-1-ND] 2.5 x 2.0mm - MEMs SMT Crystal 16.0 MHz 10pF 20ppm 2.5 x 2.0mm Crystal [Digikey -40-85°C: 535-10923-1-ND] 3.2 x 2.5mm - MEMs SMT Crystal 12.0 MHz 8pF 15ppm 3.2 x 2.5mm Crystal [Digikey: -10-70°C: 644-1047-1-ND -40-125°C: 644-1128-1-ND] 16.0 MHz 8pF 15ppm 3.2 x 2.5mm Crystal [Digikey: -10-70°C: 644-1049-1-ND -40-125°C: 644-1129-2-ND] 16.0 MHz 10pF 10ppm 3.2 x 2.5mm Crystal [Digikey: 644-1100-1-ND] 27.12 MHz 18pF 30ppm 3.2 x 2.5mm Crystal [Digikey: 887-1424-1-ND] 27.12MHz 10pF 10ppm 3.2 x 2.5mm Crystal [Digikey: 887-1329-1-ND] 4.9 x 1.8mm - MEMs SMT Crystal 32.768 KHz 12.5pF 20ppm 4.9 x 1.8mm Crystal [Digikey: SE2415CT-ND] 8.0 x 3.8mm - Surface Mount Crystal 32.768kHz 12.5pF 20ppm -40°C-85°C [Digikey: 535-9166-2-ND] Cylinder 32.768KHz Cylinder Crystal (2x6mm body) [Ex. Digikey: 300-8341-2-ND]

## Board
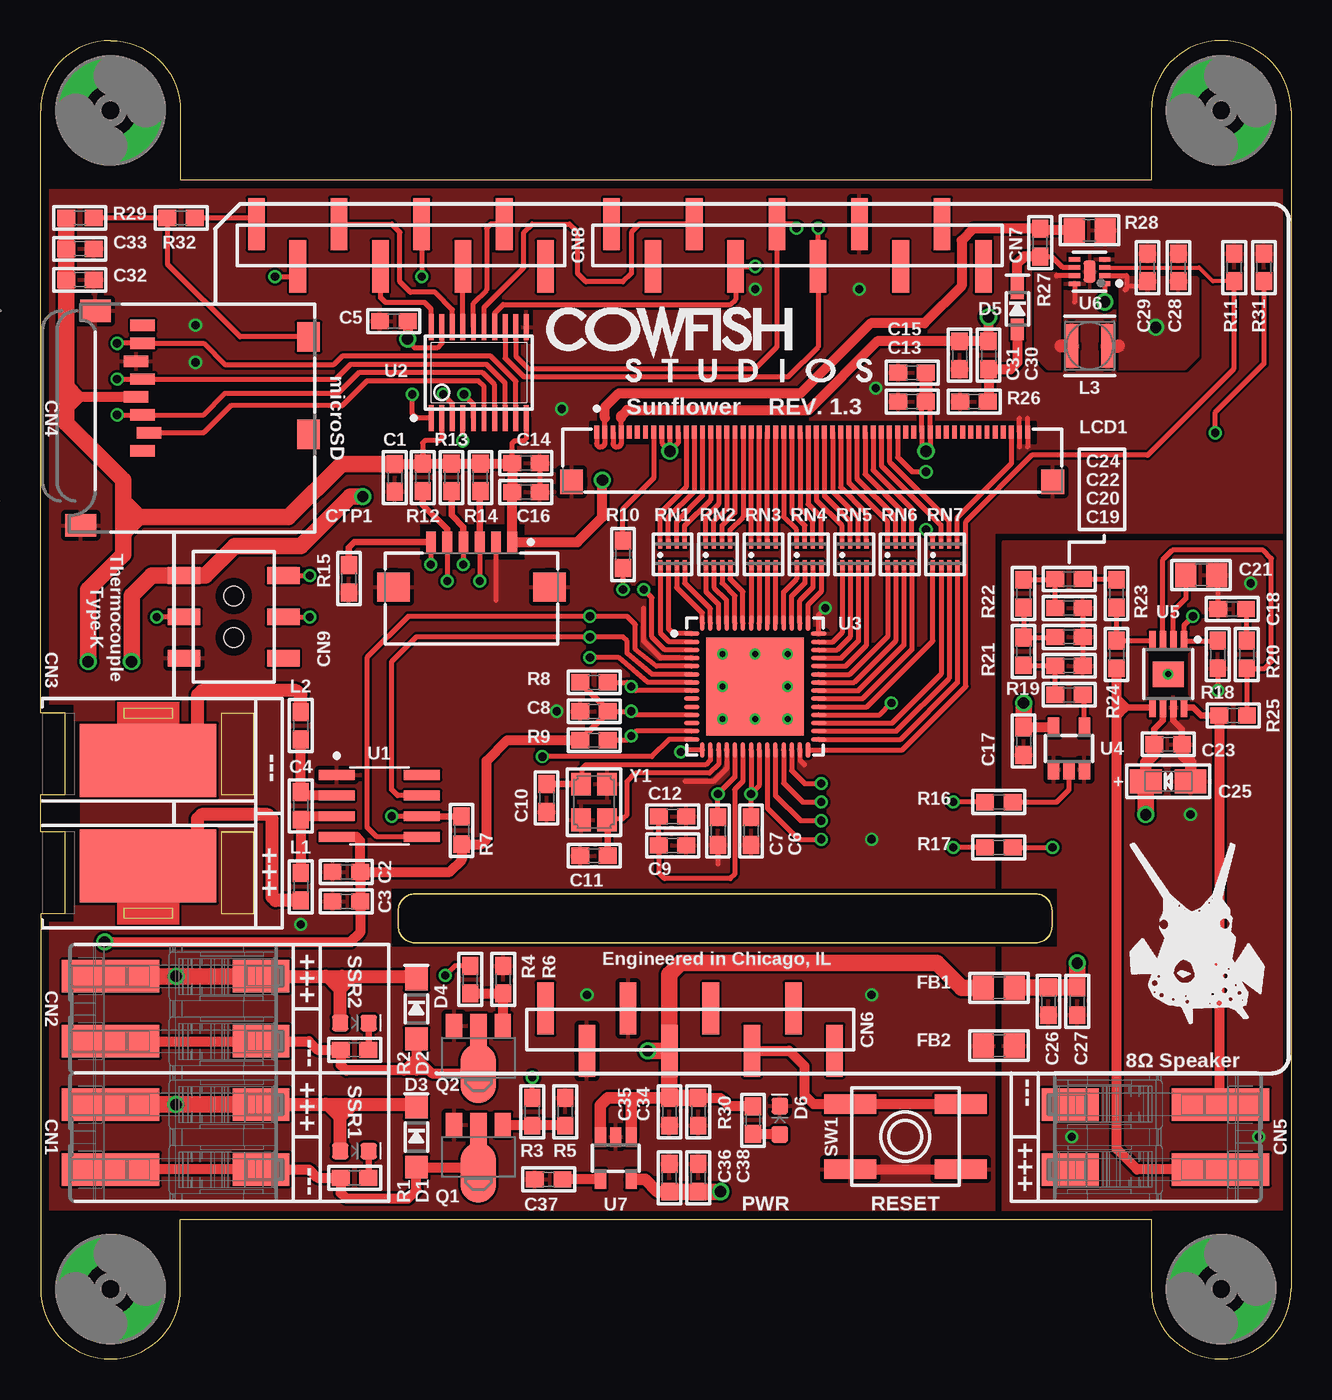
[diagram p3: board, top side]
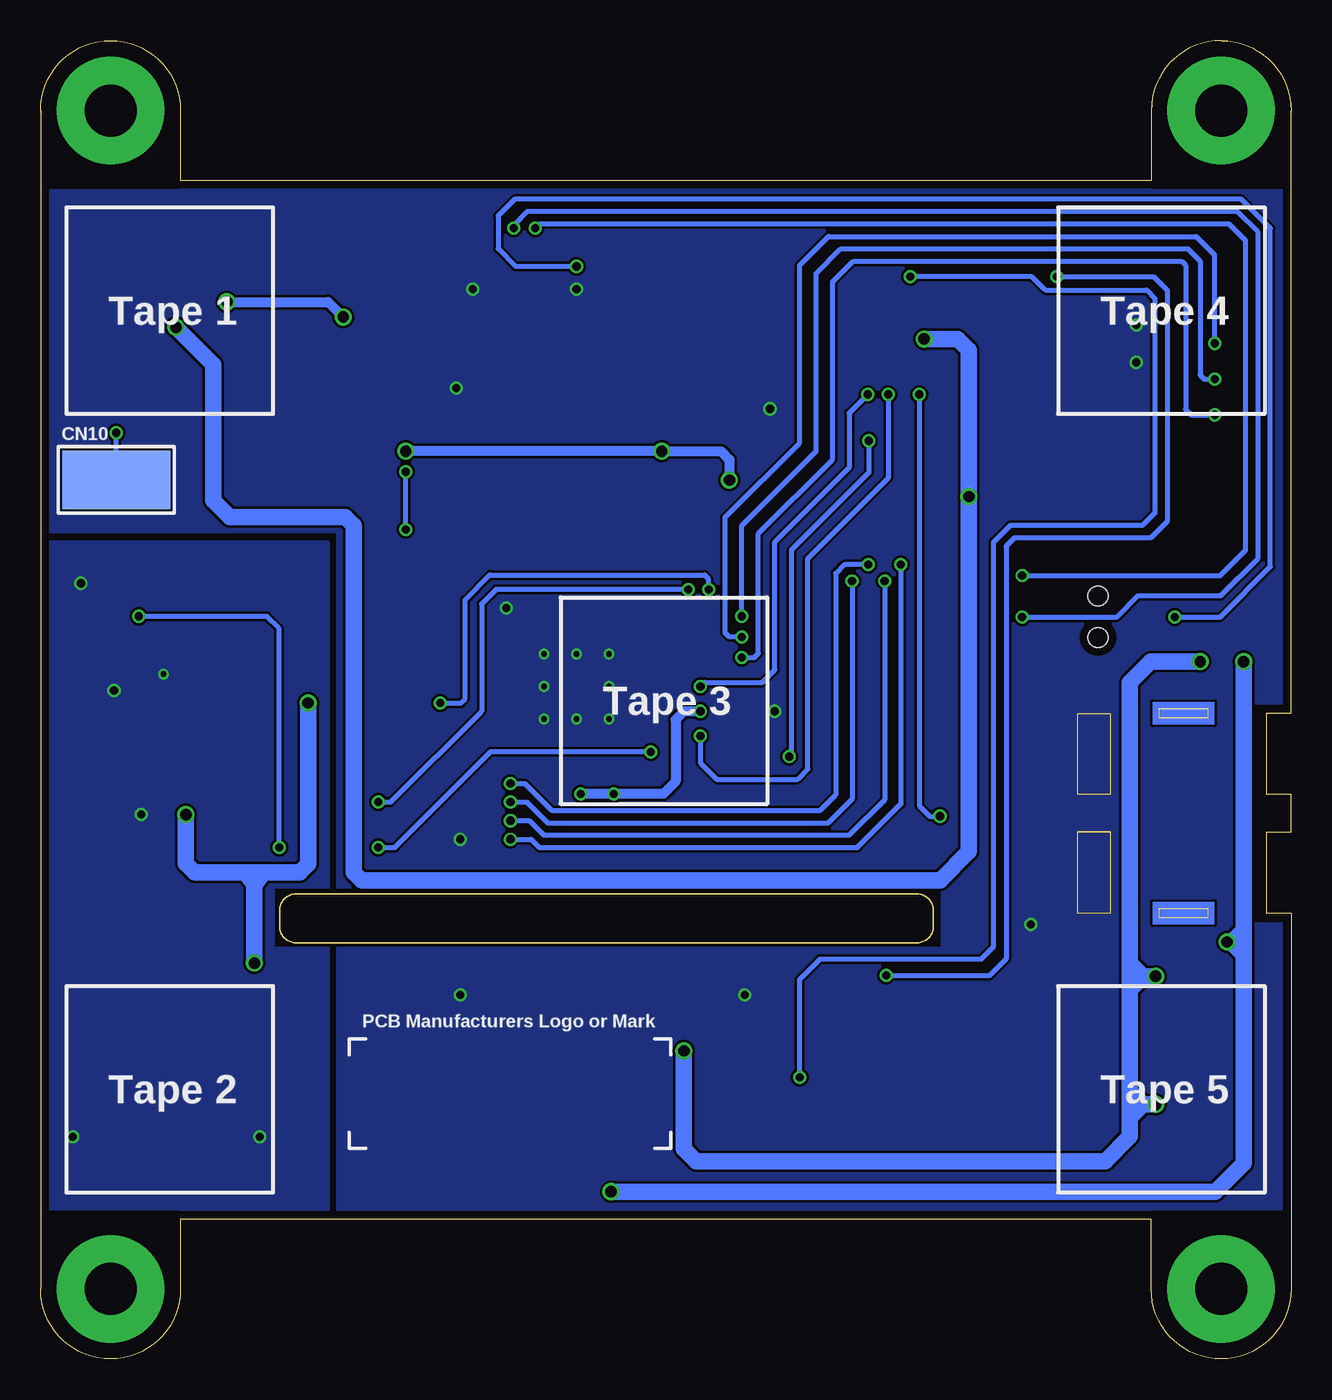
[diagram p4: board, bottom side, seen from below]

Size 76.9 x 81.1 mm. Coordinates in mm from the lower left corner, seen from the top.
Outline: 68.3,72.5 8.6,72.5 8.6,76.8 arc90 4.3,81.1 arc90 0,76.8 0,39.72 1.5,39.72 1.5,34.72 0,34.72 0,32.42 1.5,32.42 1.5,27.42 0,27.42 0,4.3 arc90 4.3,0 arc90 8.6,4.3 8.6,8.6 68.3,8.6 68.3,4.3 arc90 72.6,0 arc90 76.9,4.3 76.9,76.8 arc90 72.6,81.1 arc90 68.3,76.8 68.3,72.5
Copper layers (1*16): Top 0.035mm / dielectric 1.6mm / Bottom 0.035mm
Design rules "Elecrow_2-layer_PCB_eagle_rule": minimum track width 6mil, minimum drill 12mil, track to track 6mil, track to pad 6mil, pad to pad 6mil, via to via 8mil, smd to smd 0mil, copper to edge 20mil, drill to drill 10mil, minimum pad ring 6mil, minimum via ring 6mil, stop-mask expansion 0mil, vias tented up to drill 100mil, thermal gap 10mil
tKeepout: area 67.2,50 to 77,61.6; area 65,20.9 to 77,29.9
tRestrict: area 68.4,8.4 to 76.4,9.1; area 0.5,8.4 to 8.5,9.1; area 0.5,72 to 8.5,72.8; area 68.4,72 to 76.4,72.8; area 21.6,25.4 to 62.5,28.9; area 64.3,67.6 to 64.4,67.9; area 64.6,67.6 to 64.7,67.9; area 64,67.8 to 64.3,67.9; area 64.7,67.8 to 64.9,67.9; area 64.3,66 to 64.4,66.2; area 64.6,66 to 64.7,66.2; area 63.1,67.8 to 64.4,67.9; 53 more areas
bRestrict: area 68.4,8.4 to 76.4,9.1; area 0.5,8.4 to 8.5,9.1; area 0.5,72 to 8.5,72.8; area 68.4,72 to 76.4,72.8; area 21.6,25.4 to 62.5,28.9; area 0,39.7 to 2.3,40.2; area 0,26.9 to 2.3,27.4
Milling: 9 lines

### Footprints (pad centres in the part's own frame; a part is rotated, then mirrored left to right if it is on the bottom)
0603 = smd 1.1 x 1: 1 -0.85,0; 2 0.85,0
0805 = smd 1.3 x 1.5: 1 -0.95,0; 2 0.95,0
EIA3216-18/A-R = smd 1.95 x 1.5: + 1.375,0; - -1.375,0
P-2060-452/998-404 = smd 6 x 2: L1 4.625,2; L2 4.625,-2 | smd 3.5 x 2: L1.2 -4.625,2; L2.2 -4.625,-2
THERMOCOUPLE_CLIP_INSIDE = smd 4.5 x 8.4: + 3.25,0; - -3.25,0
MICROSD = smd 0.7 x 1.5: 1 9,-10.64; 2 7.9,-10.24; 3 6.8,-10.64; 4 5.7,-11.04; 5 4.6,-10.64; 6 3.5,-11.04; 7 2.4,-10.64; 8 1.3,-10.64 | smd 1.8 x 1.4: CD1 2,-0.44; CD2 8,-0.44 | smd 1.4 x 1.9: MT1 0.4,-13.54; MT2 13.6,-14.44
1X08_SMD_M_LEYCONN = smd 1.02 x 3.2: 1 8.89,-1.3; 2 6.35,1.3; 3 3.81,-1.3; 4 1.27,1.3; 5 -1.27,-1.3; 6 -3.81,1.3; 7 -6.35,-1.3; 8 -8.89,1.3
1X10_SMD_M_LEYCONN = smd 1.02 x 3.2: 1 11.43,-1.3; 2 8.89,1.3; 3 6.35,-1.3; 4 3.81,1.3; 5 1.27,-1.3; 6 -1.27,1.3; 7 -3.81,-1.3; 8 -6.35,1.3; 9 -8.89,-1.3; 10 -11.43,1.3
2X3_SMD_F_LEYCONN = smd 1.02 x 2: 1 -2.54,3.05; 2 -2.54,-3.05; 3 0,3.05; 4 0,-3.05; 5 2.54,3.05; 6 2.54,-3.05 | hole 1.2: -1.27,0; 1.27,0
S7081-42R = smd 6.65 x 3.6: P$1 0,0
FPC_686106148922 = smd 0.6 x 1.3: 1 -2.5,-2.54; 2 -1.5,-2.54; 3 -0.5,-2.54; 4 0.5,-2.54; 5 1.5,-2.54; 6 2.5,-2.54 | smd 2 x 1.8: SUPPORT1 -4.8,0.21; SUPPORT2 4.8,0.21
LED-0603 = smd 1 x 1: A -0.877,0; C 0.877,0
SOD-123 = smd 1.4 x 1.4: A 1.85,0; C -1.85,0
SOD-323 = smd 1.35 x 0.8: A 1.27,0; C -1.27,0
MOUNTINGHOLE_3.2_PLATED = drill 3.2 pad 6.6: P$1 0,0
INDUCTOR_3X3MM_TY_NR = smd 0.8 x 2.7: P$1 -1.1,0; P$2 1.1,0
FPC_51296_5494 = smd 0.3 x 0.8: P$1 13.25,0; P$2 12.75,0; P$3 12.25,0; P$4 11.75,0; P$5 11.25,0; P$6 10.75,0; P$7 10.25,0; P$8 9.75,0; P$9 9.25,0; P$10 8.75,0; P$11 8.25,0; P$12 7.75,0; P$13 7.25,0; P$14 6.75,0; P$15 6.25,0; P$16 5.75,0; P$17 5.25,0; P$18 4.75,0; P$19 4.25,0; P$20 3.75,0; P$21 3.25,0; P$22 2.75,0; P$23 2.25,0; P$24 1.75,0; P$25 1.25,0; P$26 0.75,0; P$27 0.25,0; P$28 -0.25,0; P$29 -0.75,0; P$30 -1.25,0; P$31 -1.75,0; P$32 -2.25,0; P$33 -2.75,0; P$34 -3.25,0; P$35 -3.75,0; P$36 -4.25,0; P$37 -4.75,0; P$38 -5.25,0; P$39 -5.75,0; P$40 -6.25,0; P$41 -6.75,0; P$42 -7.25,0; P$43 -7.75,0; P$44 -8.25,0; P$45 -8.75,0; P$46 -9.25,0; P$47 -9.75,0; P$48 -10.25,0; P$49 -10.75,0; P$50\ -11.25,0; P$51 -11.75,0; P$52 -12.25,0; P$53 -12.75,0; P$54 -13.25,0 | smd 1.4 x 1.5: SUPPORT1 14.8,3.05; SUPPORT2 -14.8,3.05
SOT-89-3 = smd 1 x 1.5: B -1.499,-1.981; E 1.499,-1.981 | smd 1 x 2: C 0,-1.727 | smd 2.2 x 3.7: C@1 0,0.94
741-8 = smd 0.25 x 0.61: 1 -0.75,-0.65; 2 -0.25,-0.65; 3 0.25,-0.65; 4 0.75,-0.65; 5 0.75,0.65; 6 0.25,0.65; 7 -0.25,0.65; 8 -0.75,0.65
EVQ-Q2 = smd 3.2 x 1.2: A -3.4,-2; A' 3.4,-2; B -3.4,2; B' 3.4,2
SOIC8 = smd 0.61 x 2.21: 1 -1.905,-2.616; 2 -0.635,-2.616; 3 0.635,-2.616; 4 1.905,-2.616; 5 1.905,2.616; 6 0.635,2.616; 7 -0.635,2.616; 8 -1.905,2.616
TSSOP-20PIN = smd 0.3 x 1.6: 1 -2.925,-2.8; 2 -2.275,-2.8; 3 -1.625,-2.8; 4 -0.975,-2.8; 5 -0.325,-2.8; 6 0.325,-2.8; 7 0.975,-2.8; 8 1.625,-2.8; 9 2.275,-2.8; 10 2.925,-2.8; 11 2.925,2.8; 12 2.275,2.8; 13 1.625,2.8; 14 0.975,2.8; 15 0.325,2.8; 16 -0.325,2.8; 17 -0.975,2.8; 18 -1.625,2.8; 19 -2.275,2.8; 20 -2.925,2.8
VQFN-56PIN = smd 0.28 x 0.95: 1 -3.25,-3.9; 2 -2.75,-3.9; 3 -2.25,-3.9; 4 -1.75,-3.9; 5 -1.25,-3.9; 6 -0.75,-3.9; 7 -0.25,-3.9; 8 0.25,-3.9; 9 0.75,-3.9; 10 1.25,-3.9; 11 1.75,-3.9; 12 2.25,-3.9; 13 2.75,-3.9; 14 3.25,-3.9; 29 3.25,3.9; 30 2.75,3.9; 31 2.25,3.9; 32 1.75,3.9; 33 1.25,3.9; 34 0.75,3.9; 35 0.25,3.9; 36 -0.25,3.9; 37 -0.75,3.9; 38 -1.25,3.9; 39 -1.75,3.9; 40 -2.25,3.9; 41 -2.75,3.9; 42 -3.25,3.9 | smd 0.95 x 0.28: 15 3.9,-3.25; 16 3.9,-2.75; 17 3.9,-2.25; 18 3.9,-1.75; 19 3.9,-1.25; 20 3.9,-0.75; 21 3.9,-0.25; 22 3.9,0.25; 23 3.9,0.75; 24 3.9,1.25; 25 3.9,1.75; 26 3.9,2.25; 27 3.9,2.75; 28 3.9,3.25; 43 -3.9,3.25; 44 -3.9,2.75; 45 -3.9,2.25; 46 -3.9,1.75; 47 -3.9,1.25; 48 -3.9,0.75; 49 -3.9,0.25; 50 -3.9,-0.25; 51 -3.9,-0.75; 52 -3.9,-1.25; 53 -3.9,-1.75; 54 -3.9,-2.25; 55 -3.9,-2.75; 56 -3.9,-3.25 | smd 6 x 6: EP 0,0 | drill 0.35: TV@1 -2,2; TV@2 -2,0; TV@3 -2,-2; TV@4 0,-2; TV@5 2,-2; TV@6 2,0; TV@7 2,2; TV@8 0,2
SOT23-5PIN = smd 0.7 x 1.2: 1 -0.95,-1.3; 2 0,-1.3; 3 0.95,-1.3; 4 0.95,1.3; 5 -0.95,1.3
MSOP-8PIN = smd 0.4 x 1.2: 1 -0.975,-2.05; 2 -0.325,-2.05; 3 0.325,-2.05; 4 0.975,-2.05; 5 0.975,2.05; 6 0.325,2.05; 7 -0.325,2.05; 8 -0.975,2.05 | smd 1.89 x 1.57: EP 0,0 | drill 0.35: TV 0,0
MLF-8PIN = smd 0.7 x 0.3: 1 -0.927,0.75; 2 -0.927,0.25 | smd 0.7 x 0.28: 3 -0.927,-0.25; 4 -0.927,-0.75; 5 0.927,-0.75; 6 0.927,-0.25; 7 0.927,0.25; 8 0.927,0.75 | smd 0.75 x 1.35: EP 0,0
CRYSTAL_3.2X2.5 = smd 1.4 x 1.2: 1 -1.1,-0.8; 2 1.1,0.8; GND1 -1.1,0.8; GND2 1.1,-0.8

### Placement (x,y rotation side)
C1  21.78,54.2 270 top
C2  18.8,29.96 180 top
C3  18.8,28.14 180 top
C4  16,34.02 90 top
C5  21.72,63.84 180 top
C6  43.69,32.48 270 top
C7  41.66,32.48 270 top
C8  34.04,39.84 180 top
C9  38.86,31.59 0 top
C10  31.11,34.51 270 top
C11  34.04,30.95 0 top
C12  38.86,33.37 0 top
C13  53.59,58.89 180 top
C14  29.84,55.11 0 top
C15  53.59,60.67 180 top
C16  29.84,53.33 0 top
C17  60.45,38 270 top
C18  73.28,46.13 180 top
C19  63.25,42.64 0 top
C20  63.25,44.41 0 top
C21  71.37,48.22 0 top
C22  63.25,46.19 0 top
C23  69.34,37.81 0 top
C24  63.25,47.97 0 top
C25  69.34,35.52 180 top
C26  61.98,22 270 top
C27  63.75,22 270 top
C28  69.98,67.15 90 top
C29  68.07,67.15 90 top
C30  58.29,61.75 270 top
C31  56.52,61.75 270 top
C32  2.41,66.38 0 top
C33  2.41,68.29 0 top
C34  40.45,15.2 270 top
C35  38.67,15.2 270 top
C36  38.67,11.14 90 top
C37  31.24,11.05 180 top
C38  40.45,11.14 90 top
CN1  8.93,13.65 180 top
CN2  8.93,21.54 180 top
CN3  6.61,33.57 270 top
CN4  16.91,64.88 270 top
CN5  67.94,13.65 0 top
CN6  39.94,20.25 0 top
CN7  46.54,68.51 0 top
CN8  22.16,68.51 0 top
CN9  11.87,45.65 270 top
CN10  72.25,54.07 0 bottom
CTP1  26.5,47.7 180 top
D1  19.3,12.79 0 top
D2  19.3,20.66 0 top
D3  23.11,13.65 270 top
D4  23.11,21.53 270 top
D5  60.07,64.61 270 top
D6  45.47,14.68 90 top
FB1  58.93,22.82 0 top
FB2  58.93,19.27 0 top
H1  4.3,76.8 0 top
H2  72.6,76.8 0 top
H3  4.3,4.3 0 top
H4  72.6,4.3 0 top
L1  16,29.05 270 top
L2  16,38.95 90 top
L3  64.52,62.32 180 top
LCD1  47.45,57.01 180 top
Q1  26.92,12.41 180 top
Q2  26.92,18.51 180 top
R1  19.3,11.13 0 top
R2  19.3,19.01 0 top
R3  30.23,15.2 270 top
R4  26.42,23.33 270 top
R5  32.26,15.2 270 top
R6  28.45,23.33 270 top
R7  25.89,32.51 270 top
R8  34.04,41.62 180 top
R9  34.04,38.06 180 top
R10  35.81,49.49 90 top
R11  73.41,67.15 270 top
R12  23.5,54.23 90 top
R13  25.27,54.23 90 top
R14  27.05,54.23 90 top
R15  18.96,48 90 top
R16  58.93,34.25 0 top
R17  58.93,31.46 0 top
R18  72.39,43.33 90 top
R19  63.25,40.86 180 top
R20  74.17,43.33 270 top
R21  60.45,43.52 90 top
R22  60.45,47.08 90 top
R23  66.17,47.08 90 top
R24  66.17,43.33 270 top
R25  73.34,39.59 180 top
R26  57.4,58.89 0 top
R27  61.47,68.67 90 top
R28  64.52,69.43 180 top
R29  2.41,70.19 180 top
R30  43.81,14.68 90 top
R31  75.23,67.15 90 top
R32  8.64,70.19 180 top
RN1  38.86,49.49 0 top
RN2  41.66,49.49 0 top
RN3  44.45,49.49 0 top
RN4  47.24,49.49 0 top
RN5  50.04,49.49 0 top
RN6  52.83,49.49 0 top
RN7  55.63,49.49 0 top
SW1  53.18,13.67 180 top
U1  20.83,34.02 270 top
U2  26.94,60.67 0 top
U3  43.94,41.37 270 top
U4  63.25,37.56 0 top
U5  69.34,42.13 180 top
U6  64.52,66.89 180 top
U7  35.37,12.35 180 top
Y1  34.04,34.25 270 top

### Tracks (layer width: path | path; a pad name or v marks a point on that pad's centre or on a via)
3.3V  (via drill 0.5, 0.7)
  Top 0.305: C6.1 v43.69,34.76 | C7.1 v41.66,34.76 42.69,35.8 U3.19 | U3.21 v43.69,34.77 v43.69,34.76 | U3.22 44.19,35.27 v43.69,34.76 | U3.11 36.55,39.62 v36.32,39.84 C8.1 | 54.2,58.71 C13.1 | 54.7,58.57 C13.1 | C13.1 54.2,58.65 LCD1.P$41 54.2,56.09 v54.45,55.84 54.7,56.09 LCD1.P$42 54.7,58.55 54.36,58.89 | 54.7,58.64 C13.1 | C8.1 34.89,39.76 | C8.1 34.89,39.92 | LCD1.P$10 v38.7,55.84 | LCD1.P$11 39.2,56.34 v38.7,55.84 | LCD1.P$9 38.2,56.34 v38.7,55.84 | U2.2 24.67,56.64 24.51,56.48 23.62,56.48 23.5,56.35 R12.2 | C14.1 29,56.33 29.15,56.48 29.72,56.48 29.87,56.63 U2.10
  Top 0.406: 34.89,39.76 R9.2 | 34.89,39.92 R8.2
  Top 0.61: C2.1 C3.1 19.65,26.22 19.08,25.65 v3.94,25.65 | U1.4 19.41,32.12 19.65,31.88 C2.1 | C2.1 25.17,29.96 25.89,30.68 R7.2 27.12,31.66 27.43,31.97 27.43,36.79 28.7,38.06 R9.2 | CN4.4 2.45,59.18 | 2.45,59.18 1.85,59.18 1.56,58.89 | 2.45,59.18 2.41,59.21 | 2.41,59.21 1.71,59.91 | 2.41,59.21 2.41,59.15 1.59,58.32 | C1.1 23.5,55.05 R12.2 R13.2 R14.2 29,55.08 C14.1 C16.1 CTP1.1 33,50.24 34.54,51.78 v34.54,54.07 | 5.33,52.8 6.35,51.78 5.33,50.76
  Top 0.711: U7.5 37.18,11.05 37.93,10.29 C36.1
  Top 0.813: C15.1 C13.1
  Top 1.016: C36.1 C38.1 v41.82,10.29 | R29.2 C33.1 C32.1 1.56,58.89 1.56,57.58 5.08,54.07 5.08,51.78 | v2.92,42.89 2.92,46.19 2.92,46.57 2.92,47.34 5.08,49.49 5.08,51.78 | 5.08,51.78 6.35,51.78 15.24,51.78 18.52,55.05 C1.1
  Bottom 0.61: v54.45,55.84 v38.7,55.84 35.05,55.84 34.54,55.34 v34.54,54.07 | v43.69,34.76 v41.66,34.76 38.61,34.76 37.85,35.52 37.85,39.33 37.34,39.84 v36.32,39.84
  Bottom 1.016: v41.82,10.29 4.66,10.29 2.92,12.03 2.92,24.86 | 2.92,24.86 2.92,26.38 | 2.92,26.38 v2.92,42.89 | v3.94,25.65 3.65,25.65 2.92,26.38 | 2.92,24.86 3.68,25.62 3.94,25.62
5V  (via drill 0.7)
  Top 0.305: U2.19 24.67,62.48 24.38,62.19 22.99,62.19 v22.57,62.75 | 67.05,66 67.66,66.02 C29.1 | U6.2 66.78,66.64 66.78,65.86 66.67,65.75
  Top 0.61: C34.1 41.82,16.05 42.34,15.54 R30.2 | C5.1 v22.57,62.75
  Top 0.711: C35.1 36.32,16.05 | 36.32,16.05 34.89,16.05 34.42,15.59 U7.3 | U7.1 36.32,16.05 | 17.53,15.71 18.39,14.85 18.43,14.85 18.45,14.85 19.05,15.46 | 17.53,23.59 18.41,22.7 18.43,22.7 18.43,22.71 19.05,23.33
  Top 0.813: CN2.L2.2 18.54,23.54 | 18.54,23.54 22.96,23.54 D4.C | D2.A 18.43,22.7 18.43,23.42 18.54,23.54 | CN1.L2.2 18.29,15.65 | 18.29,15.65 22.96,15.65 D3.C | D1.A 18.43,14.85 18.43,15.51 18.29,15.65 | L3.P$1 66.29,62.32
  Top 1.016: C34.1 C35.1 CN6.5 | CN6.5 v37.34,18.95 | FB1.1 56.64,22.82 55.12,24.35 39.37,24.35 38.67,23.65 CN6.5 | CN1.L2 v8.32,15.65 CN1.L2.2 | CN2.L2 v8.33,23.54 CN2.L2.2 | v5.59,42.89 5.59,46.95 6.82,48.19 CN9.2 10.13,48.19 11.94,50 16,50 19.05,53.05 v19.81,53.05
  Bottom 1.016: v37.34,18.95 37.34,12.92 36.58,12.16 11.43,12.16 9.91,13.68 9.91,14.82 | 9.91,14.82 9.91,15.46 | 9.91,15.46 9.91,16.47 | 9.91,16.47 9.91,22.71 | 9.91,22.71 9.91,23.33 | 9.91,23.33 9.91,24.37 | 9.91,24.37 9.91,41.62 8.64,42.89 v5.59,42.89 | v8.32,15.65 9.08,15.65 | 9.08,15.65 9.12,15.65 | 9.12,15.65 9.71,15.65 9.91,15.46 | v8.33,23.54 9.08,23.54 | 9.08,23.54 9.7,23.54 9.91,23.33 | 9.12,15.65 9.12,15.69 9.91,16.47 | 9.08,15.65 9.91,14.82 | 9.08,23.54 9.91,24.37 | 9.08,23.54 9.91,22.71 | v68.58,63.46 66.29,61.18 66.29,52.8 65.28,51.78 58.17,51.78 57.66,51.27 57.66,29.94 57.15,29.43 21.59,29.43 19.81,31.21 v19.81,53.05 19.81,62.07 20.49,62.75 v22.57,62.75
  pour Top (isolate 0.305): 66.42,66.51 71.12,66.51 71.12,61.69 70.36,60.92 65.28,60.92 65.28,63.72 66.42,63.72
AGND  (via drill 0.5)
  Top 0.305: C18.2 72.43,48.12 C21.2 | R18.1 v72.39,41.11 | C22.2 C20.2 C19.2
  Top 0.406: U5.7 69.67,39.26 70.19,38.74 C23.2
  Top 0.711: C23.2 70.19,37.21 70.72,36.69 C25.-
  other vias: 74.42,47.72 63.42,13.65 74.92,13.65 70.72,33.49
  pour Top: 59.25,8.6 59.25,50.26 76.9,50.26 76.9,8.6
  pour Bottom: 59.25,8.6 76.9,8.6 76.9,50.26 59.25,50.26
AUD_PD#  (via drill 0.5)
  Top 0.305: U3.15 39.5,37.47 v39.37,37.34 | R17.1 v56.13,31.46
  Bottom 0.305: v39.37,37.34 49.24,37.34 55.12,31.46 v56.13,31.46
AUDIO_L  (via drill 0.5)
  Top 0.305: U3.3 38.39,43.62 37.59,44.41 37.59,46.83 v37.08,47.34 | R16.1 v56.13,34.25
  Bottom 0.305: v37.08,47.34 48.9,47.34 49.78,46.45 49.78,39.84 55.37,34.25 v56.13,34.25
AUDIO_L_OUT
  Top 0.305: C24.2 66.25,47.97 R23.2
AVDD  (via drill 0.7)
  Top 0.406: U5.6 69.02,39.26 68.49,38.74 C23.1
  Top 0.61: U4.5 C17.1
  Top 0.711: C23.1 68.49,37.21 67.97,36.69 C25.+ | 59.88,22.91 FB1.2 59.9,22.85
  Top 1.016: C17.1 v60.45,40.35 | v63.75,24.35 C27.1 C26.1 59.9,22.85 | C25.+ v67.97,33.49
  Bottom 0.711: 63.75,28.92 63.75,29.94 | 63.75,28.92 64.52,29.94 | 63.75,28.92 62.99,29.94
  Bottom 1.016: v60.45,40.35 60.45,30.44 60.96,29.94 62.99,29.94 63.75,29.94 64.52,29.94 67.44,29.94 67.97,30.47 v67.97,33.49 | v63.75,24.35 63.75,28.92
B0
  Top 0.305: RN5.8 49.29,51.26 47.7,52.85 LCD1.P$28
B1
  Top 0.305: RN5.7 49.79,51.52 48.2,53.11 LCD1.P$29
B2
  Top 0.305: RN5.6 50.29,51.78 48.7,53.37 LCD1.P$30
B3
  Top 0.305: RN5.5 50.79,52.05 49.2,53.63 LCD1.P$31
B4
  Top 0.305: RN6.8 52.08,51.51 49.7,53.9 LCD1.P$32
B5
  Top 0.305: RN6.7 52.58,51.78 50.2,54.16 LCD1.P$33
B6
  Top 0.305: RN6.6 53.08,52.04 50.7,54.42 LCD1.P$34
B7
  Top 0.305: RN6.5 53.58,52.3 51.2,54.68 LCD1.P$35
BL_PWM
  Top 0.254: U6.3 71.25,67.14 72.1,66.3 R11.2
  Top 0.305: U3.28 53,37.47 56.9,41.37 56.9,51.53 60.96,55.59 68.07,55.59 73.41,60.92 R11.2 73.41,66.51
CTP_INT#  (via drill 0.5)
  Top 0.305: CTP1.5 v25,47.85 | U3.24 45.19,34.66 46.74,33.11 v48.01,33.11
  Top 0.406: R12.1 23.5,52.54 25,51.04 CTP1.5
  Bottom 0.305: v25,47.85 25,34.4 27.18,32.22 45.97,32.22 46.86,33.11 v48.01,33.11
CTP_RST#  (via drill 0.5)
  Top 0.305: CTP1.6 v24,48.87 | U3.23 44.69,33.88 46.61,31.97 v48.01,31.97
  Top 0.406: CTP1.6 19.29,50.24 18.96,49.91 R15.2
  Bottom 0.305: v24,48.87 24,34.13 26.67,31.46 46.23,31.46 46.74,31.97 v48.01,31.97
CTP_SCL  (via drill 0.5)
  Top 0.305: CTP1.3 v27,47.85 | U3.25 45.69,35.42 46.86,34.25 v48.01,34.25
  Top 0.406: CTP1.3 27,53.33 R14.1
  Bottom 0.305: v27,47.85 27,34.43 28.45,32.98 45.72,32.98 46.99,34.25 v48.01,34.25
CTP_SDA  (via drill 0.5)
  Top 0.305: CTP1.4 v26,48.87 | U3.26 46.19,36.2 46.99,35.4 v48.01,35.4
  Top 0.406: CTP1.4 26,51.18 25.27,51.91 R13.1
  Bottom 0.305: v26,48.87 27.47,48.87 28,48.33 28,34.7 28.96,33.75 45.47,33.75 47.12,35.4 v48.01,35.4
D1  (via drill 0.5)
  Top 0.305: R4.1 25.49,24.18 v24.89,23.59 | v14.41,66.57 15.81,66.57 CN8.7
  Bottom 0.305: v14.41,66.57 8.44,66.57 7.62,65.75 7.62,51.53 8.64,50.51 17.02,50.51 17.53,50 17.53,24.6 18.54,23.59 v24.89,23.59
D4  (via drill 0.5)
  Top 0.305: R3.1 v30.23,17.32 | CN8.4 v23.43,66.57
  Bottom 0.305: v30.23,17.32 30.23,23.33 28.96,24.6 19.05,24.6 18.29,25.36 18.29,50.26 17.27,51.27 9.14,51.27 8.38,52.03 8.38,65.24 8.89,65.75 15.11,65.75 15.94,66.57 v23.43,66.57
DE
  Top 0.305: RN7.5 56.38,51.77 59.7,55.09 LCD1.P$52
DISP
  Top 0.305: LCD1.P$8 37.7,54.17 35.81,52.29 R10.2
DISP_CS#-3V  (via drill 0.5)
  Top 0.305: U3.8 36.57,41.12 v36.32,41.37 36.07,41.62 R8.1 | U2.5 26.62,58.75 v26.04,59.34
  Bottom 0.305: v36.32,41.37 36.07,41.62 32.51,41.62 31.75,42.38 31.75,50.26 27.18,54.83 27.18,58.19 v26.04,59.34
DISP_CS#-5V
  Top 0.305: CN8.2 27.68,69.81 27.43,69.56 27.43,65.75 26.62,64.94 U2.16
DISP_INT#-3V  (via drill 0.5)
  Top 0.305: U3.13 36.62,38.62 v36.32,38.32 36.07,38.06 R9.1 | U2.3 25.32,58.78 v24.77,59.34
  Bottom 0.305: v24.77,59.34 24.77,54.19 29.72,49.24 29.72,36.29 30.35,35.65 35.31,35.65 36.32,36.67 v36.32,38.32
DISP_INT#-5V
  Top 0.305: CN8.6 21.59,69.81 22.1,69.31 22.1,66.26 22.73,65.62 24.26,65.62 25.32,64.56 U2.18
DISP_PD#-3V  (via drill 0.5)
  Top 0.305: U3.14 38.66,38.12 37.59,37.05 v30.86,37.05 | v25.97,56.48 U2.4
  Bottom 0.305: v25.97,56.48 25.97,54.51 30.73,49.75 30.73,37.17 v30.86,37.05
DISP_PD#-5V
  Top 0.305: U2.17 CN8.3
G0
  Top 0.305: RN3.8 LCD1.P$20
G1
  Top 0.305: RN3.7 LCD1.P$21
G2
  Top 0.305: RN3.6 LCD1.P$22
G3
  Top 0.305: RN3.5 LCD1.P$23
G4
  Top 0.305: RN4.8 46.49,51.01 45.7,51.8 LCD1.P$24
G5
  Top 0.305: LCD1.P$25 46.2,52.06 46.99,51.27 RN4.7
G6
  Top 0.305: LCD1.P$26 46.7,52.32 47.5,51.53 47.49,51.52 RN4.6
G7
  Top 0.305: LCD1.P$27 47.2,52.59 47.99,51.79 RN4.5
GND  (via drill 0.5)
  Top 0.305: C14.2 C16.2 | U3.27 46.69,36.84 46.99,36.54 | U3.42 47.84,45.77 v48.26,46.19 | U3.18 42.19,36.31 41.4,35.52 39.62,35.52 | C7.2 41.66,30.44 | CTP1.2 28,46.68 | U3.4 38.13,43.12 37.08,44.16 37.08,46.19 | 31.31,47.5 CTP1.SUPPORT1 | U6.8 63.59,65.03 | LCD1.P$53 60.2,57.88 | LCD1.P$54 60.71,57.88 | LCD1.P$53 | LCD1.P$53 60.2,56.1 | LCD1.P$54 | LCD1.P$54 60.71,56.1
  Top 0.61: SW1.B' SW1.B
  other vias: 31.75,39.84 33.6,22.4 50.33,65.81 51.1,31.97 51.35,59.72 32.05,58.45 43.95,65.81 9.53,61.3 9.53,63.59 16,26.72 51.1,22.4
  pour Bottom (rank 2): 0,8.6 58.61,8.6 58.61,50.89 76.9,50.89 76.9,72.61 0,72.61
  pour Top (rank 2): 0,8.6 58.61,8.6 58.61,50.89 76.9,50.89 76.9,72.61 0,72.61
HSYNC
  Top 0.305: RN7.7 55.38,51.27 51.7,54.94 LCD1.P$36
LED_A  (via drill 0.7)
  Top 0.305: U6.1 v65.44,65.03 | 35.7,57.91 LCD1.P$4 35.7,56.33 arc-90 35.43,56.1 arc-90 35.2,56.33 LCD1.P$3
  Top 0.61: 35.7,57.91 35.7,58.02 36.07,58.38 47.24,58.38 51.46,62.6 C31.1 C30.1 v58.29,64.1
  Bottom 0.61: v65.44,65.03 59.22,65.03 v58.29,64.1
LED_K
  Top 0.305: 34.7,57.91 LCD1.P$2 34.7,56.33 arc-90 34.42,56.1 arc-90 34.2,56.33 LCD1.P$1
  Top 0.61: R28.2 61.3,69.43 R27.2 57.37,69.52 56.64,68.8 56.64,66 54.36,63.72 51.05,63.72 46.74,59.4 35.56,59.4 34.7,58.54 34.7,57.91
N$1
  Top 0.305: U3.2 38.65,44.12 38.11,44.66 RN1.1
N$2
  Top 0.305: U3.1 38.91,44.62 38.61,44.92 RN1.2
N$3
  Top 0.305: U3.56 40.69,45.89 39.11,47.47 RN1.3
N$4
  Top 0.305: U3.55 41.19,46.15 39.61,47.73 RN1.4
N$5
  Top 0.305: RN2.1 40.91,47.2 41.69,46.41 U3.54
N$6
  Top 0.305: RN2.2 41.41,47.46 42.19,46.67 U3.53
N$7
  Top 0.305: RN2.3 41.91,47.72 42.69,46.93 U3.52
N$8
  Top 0.305: U3.51 43.19,47.2 42.41,47.98 RN2.4
N$9
  Top 0.305: RN3.1 U3.50
N$10
  Top 0.305: RN3.2 U3.49
N$11
  Top 0.305: RN3.3 U3.48
N$12
  Top 0.305: RN3.4 U3.47
N$13
  Top 0.305: U3.46 45.69,47.18 46.49,47.98 RN4.1
N$14
  Top 0.305: U3.45 46.19,46.92 46.99,47.72 RN4.2
N$15
  Top 0.305: RN4.3 47.49,47.46 46.69,46.66 U3.44
N$16
  Top 0.305: RN4.4 47.99,47.2 47.19,46.39 U3.43
N$17
  Top 0.305: U3.41 48.72,44.12 49.29,44.68 RN5.1
N$18
  Top 0.305: U3.40 48.99,43.62 49.79,44.42 RN5.2
N$19
  Top 0.305: U3.39 49.25,43.12 50.29,44.16 RN5.3
N$20
  Top 0.305: U3.38 49.51,42.62 50.79,43.89 RN5.4
N$21
  Top 0.305: RN6.1 52.08,44.43 49.77,42.12 U3.37
N$22
  Top 0.305: RN6.2 52.58,44.16 50.03,41.62 U3.36
N$23
  Top 0.305: RN6.3 53.08,43.9 50.3,41.12 U3.35
N$24
  Top 0.305: U3.34 50.56,40.62 53.58,43.64 RN6.4
N$25
  Top 0.305: U3.33 50.82,40.12 54.88,44.17 RN7.1
N$26
  Top 0.305: U3.31 52.36,39.12 55.38,42.13 RN7.2
N$27
  Top 0.305: U3.30 52.62,38.62 55.88,41.87 RN7.3
N$28
  Top 0.305: U3.29 52.88,38.12 56.38,41.61 RN7.4
N$29  (via drill 0.5)
  Top 0.305: v72.25,56.97 72.25,58.24 75.23,61.23 R31.1
  Bottom 0.305: CN10.P$1 v72.25,56.97
N$30
  Top 0.61: R30.1 45.59,13.84 D6.A
N$31
  cutout Top: 33.78,56.35 61.21,56.35 61.21,57.62 33.78,57.62
N$32
  Top 0.305: R16.2 62.48,34.25 63.25,35.02 U4.2
N$33
  Top 0.305: U3.17 41.69,36.58 41.15,36.03 36.58,36.03 36.07,35.52 36.07,33.49 35.81,33.24 34.92,33.24 Y1.2
  Top 0.406: C11.2 34.89,33.1 Y1.2
N$34
  Top 0.305: U3.20 43.19,35.54 42.67,35.02 42.67,29.81 42.42,29.55 38.35,29.55 38.01,29.9 C9.1 | 38.1,31.5 C9.1 | C9.1 C12.1
N$35
  Top 0.305: U3.16 41.19,36.84 40.89,36.54 33.53,36.54 33.27,36.29 33.27,35.39 Y1.1
  Top 0.406: C10.1 Y1.1
N$36
  Top 0.305: U6.7 62.48,66.64
  Top 0.813: L3.P$2 62.74,62.32
  pour Top (isolate 0.305): 63.75,63.72 63.75,60.92 61.98,60.92 61.21,61.69 61.21,66.77 62.64,66.77 62.64,63.72
N$37
  Top 0.305: U6.6 62.87,67.14 62.19,67.82 R27.1
  Top 0.61: R27.1 60.49,67.82 60.07,67.4 D5.C
N$38
  Top 0.61: 58.31,60.88 C30.2 | 58.31,60.88 59.65,60.88 60.07,61.3 D5.A | 58.31,60.88 58.31,58.95 R26.2
N$39
  Top 0.61: U1.3 15.96,33.38 C4.1 L1.1
N$40
  Top 0.61: U1.2 15.96,34.66 C4.2 L2.1
N$41
  Top 0.813: CN3.+ 9.65,30.32 9.65,33.24 9.91,33.49 13.97,33.49 14.22,33.24 14.22,28.41 14.44,28.2 L1.2
N$42
  Top 0.813: CN3.- 9.65,36.82 9.65,40.86 9.91,41.11 15.75,41.11 16,40.86 L2.2
N$43
  Top 0.61: U7.4 C37.1
N$44
  cutout Top: 23.37,49.24 29.72,49.24 29.72,51.27 23.37,51.27
N$45
  Top 0.61: Q1.B 28.42,14.35 R3.2 R5.2
N$47
  Top 0.61: R4.2 R6.2 28.45,20.49 Q2.B
N$48
  Top 0.254: 26.6,11.8 26.6,13.81 Q1.C
  Top 0.61: CN1.L1 CN1.L1.2 16.51,11.65 17.02,11.14 R1.1 18.45,10.21 18.8,9.87 22.61,9.87 23.11,10.38 D3.A 26.6,11.8 Q1.C@1
N$49
  Top 0.406: D1.C 20.18,10.91 R1.2
N$50
  Top 0.305: R32.1 13.27,70.19 CN8.8
N$51
  Top 0.406: R2.2 20.18,18.76 D2.C
N$52  (via drill 0.5)
  Top 0.305: v70.87,45.68 70.32,45.13 U5.1 R18.2 | R17.2 v62.23,31.46
  Bottom 0.305: v62.23,31.46 62.23,44.92 62.99,45.68 v70.87,45.68
N$53
  Top 0.305: Q2.C Q2.C@1
  Top 0.61: CN2.L1 CN2.L1.2 16.49,19.54 17.02,19.01 R2.1 18.45,18.09 18.8,17.74 22.35,17.74 | 23.88,17.74 23.11,17.74 | 23.11,17.74 22.35,17.74 | 23.11,18.51 23.11,17.74 | 23.11,18.51 23.88,17.74 | 23.11,18.51 22.35,17.74 | Q2.C@1 24.05,17.57 23.88,17.74 | D4.A 23.11,18.51
N$54
  Top 0.305: U4.4 64.2,40.76 R19.1
N$55
  Top 0.305: R19.2 C19.1 60.49,42.64 R21.1
N$57
  Top 0.305: C20.1 62.36,44.38 R21.2 R22.1
N$58
  Top 0.61: SW1.A SW1.A' 47.54,15.67 46.99,16.22 46.99,18 46.04,18.95 CN6.3
N$59  (via drill 0.5)
  Top 0.305: U3.32 51.59,39.62 v52.32,40.35 | R10.1 v35.81,47.34
  Bottom 0.305: v35.81,47.34 35.81,47.97 36.07,48.22 49.28,48.22 50.8,46.7 50.8,40.6 51.05,40.35 v52.32,40.35
N$60
  Top 0.305: U5.2 69.67,46.01 70.42,46.77 C21.1
N$61
  Top 0.305: R22.2 62.36,47.93 C24.1 C22.1
N$65
  Top 0.305: U5.3 69.02,49.17 69.6,49.75 75.18,49.75 75.69,49.24 75.69,42.89 75.29,42.48 R20.2 74.17,39.61 R25.1
N$66
  Top 0.305: R20.1 74.17,46.09 C18.1
N$71
  Top 0.305: U5.4 66.3,44.18 R24.1 R23.1
PCLK  (via drill 0.5)
  Top 0.305: LCD1.P$38 52.7,55.47 53.59,54.57 v54.45,54.57 | RN7.8 54.88,50.59 v54.45,51.02
  Bottom 0.305: v54.45,51.02 v54.45,54.57
R0
  Top 0.305: RN1.8 38.11,52.05 39.7,53.63 LCD1.P$12
R1
  Top 0.305: RN1.7 38.61,51.78 40.2,53.37 LCD1.P$13
R2
  Top 0.305: RN1.6 39.11,51.52 40.7,53.11 LCD1.P$14
R3
  Top 0.305: RN1.5 39.61,51.26 41.2,52.85 LCD1.P$15
R4
  Top 0.305: RN2.8 40.91,51.79 41.7,52.59 LCD1.P$16
R5
  Top 0.305: RN2.7 41.41,51.53 42.2,52.32 LCD1.P$17
R6
  Top 0.305: RN2.6 41.91,51.27 42.7,52.06 LCD1.P$18
R7
  Top 0.305: RN2.5 42.41,51.01 43.2,51.8 LCD1.P$19
SD_CD
  Top 0.305: R29.1 R32.2 7.79,67.36 12.27,62.88 CN4.CD1
SD_CS-3V
  Top 0.305: U2.6 27.27,59.82 26.92,60.16 20.07,60.16 18.54,58.64 11.68,58.64 10.02,56.98 CN4.2
SD_CS-5V
  Top 0.305: U2.15 27.27,64.7 29.72,67.15 29.72,69.31 30.23,69.81 32.51,69.81 33.02,69.31 33.02,66.77 33.53,66.26 35.81,66.26 36.32,66.77 36.32,69.31 36.83,69.81 CN7.8
SP+
  Top 0.305: CN5.L2
  Top 0.406: U5.5 66.61,40.08 | 66.61,40.08 66.19,40.08 66.17,40.1 | 66.61,40.08 66.61,40.16 | 66.61,40.08 66.61,40.03
  Top 0.61: CN5.L2 67.44,11.65 66.17,12.92 66.17,39.59 | 66.17,39.59 66.17,40.1 66.17,40.6 | 66.17,40.6 R24.2 | 66.61,40.16 66.17,40.6 | 66.61,40.03 66.17,39.59
SP-
  Top 0.406: 72.49,15.73 CN5.L1 | U5.8 70.88,40.08 71.37,39.59 R25.2
  Top 0.61: R25.2 72.49,15.73
SPI_MISO-3V  (via drill 0.5)
  Top 0.305: U3.6 37.6,42.12 36.07,43.4 36.07,44.16 35.81,44.41 v33.78,44.41 23.11,44.41 21.59,42.89 21.59,35.02 21.95,34.66 U1.7 | 6.3,62.45 CN4.7 | CN4.7 v4.7,62.48 | U2.9 29.22,60.15 27.69,61.69 18.54,61.69 18.03,61.18 11.32,61.18 10.02,62.48 CN4.7
  Bottom 0.305: v33.78,44.41 34.54,44.41 34.8,44.67 34.8,51.78 30.23,56.35 30.23,67.27 28.45,69.05 5.84,69.05 4.7,67.91 v4.7,62.48
SPI_MISO-5V  (via drill 0.5)
  Top 0.305: 45.02,69.56 CN7.6 | CN9.1 v16.54,48.19 | U2.12 29.22,61.68 29.97,60.92 43.94,60.92 45.27,62.26 CN7.6 | v46.49,69.56 46.23,69.81 CN7.6
  Bottom 0.305: v16.54,48.19 4.35,48.19 2.79,49.75 2.79,68.8 3.81,69.81 46.23,69.81 v46.49,69.56
SPI_MOSI-3V  (via drill 0.5)
  Top 0.305: U3.7 37.34,41.62 35.56,43.14 v33.78,43.14 | U2.7 27.92,59.93 27.18,60.67 19.56,60.67 18.29,59.4 11.34,59.4 10.02,58.08 CN4.3 v4.7,58.08
  Bottom 0.305: v33.78,43.14 33.02,43.14 32.77,43.4 32.77,50.76 28.19,55.34 28.19,66.26 26.92,67.53 6.73,67.53 6.48,67.27 6.48,58.41 6.14,58.08 v4.7,58.08
SPI_MOSI-5V  (via drill 0.5)
  Top 0.305: CN9.4 v7.15,45.65 | v43.95,67.21 CN7.7 42.73,65.18 42.42,64.86 28.45,64.86 27.92,64.33 U2.14
  Bottom 0.305: v43.95,67.21 47.69,67.21 48.77,68.29 48.77,70.32 47.75,71.34 3.05,71.34 1.27,69.56 1.27,48.73 4.35,45.65 v7.15,45.65
SPI_SCK-3V  (via drill 0.5)
  Top 0.305: U3.5 37.87,42.62 36.58,43.65 36.58,45.18 36.07,45.68 v33.78,45.68 22.61,45.68 20.07,43.14 20.07,32.73 20.68,32.12 U1.5 | v4.7,60.27 CN4.5 18.15,60.27 19.05,61.18 27.43,61.18 28.57,60.04 U2.8
  Bottom 0.305: v4.7,60.27 5.33,60.27 5.59,60.53 5.59,67.53 6.35,68.29 27.69,68.29 29.21,66.77 29.21,55.84 33.78,51.27 v33.78,45.68
SPI_SCK-5V  (via drill 0.5)
  Top 0.305: v47.81,69.56 CN7.5 47.81,62.26 45.97,60.42 29.72,60.42 28.57,61.57 U2.13 | CN9.3 v16.54,45.65
  Bottom 0.305: v16.54,45.65 10.7,45.65 9.4,46.95 4.32,46.95 2.03,49.24 2.03,69.31 3.3,70.58 46.99,70.58 47.81,69.75 v47.81,69.56
TC_CS#-3V  (via drill 0.5)
  Top 0.305: U1.6 v21.59,33.38 | U2.1 23.12,57.87 22.86,58.13 v22.86,59.34
  Top 0.406: U1.6 25.89,33.38 R7.1
  Bottom 0.305: v22.86,59.34 22.86,34.02 22.23,33.38 v21.59,33.38
TC_CS#-5V
  Top 0.305: U2.20 24.02,64.59 23.62,64.99 21.21,64.99 20.89,65.31 CN8.5
VSYNC
  Top 0.305: RN7.6 55.88,51.53 52.2,55.21 LCD1.P$37

### Text on the board
tPlace: Sunflower | REV. 1.3 | microSD | Thermocouple / Type-K | --- | + | +++ | Engineered in Chicago, IL | +++ | SSR2 | --- | --- | 8Ω Speaker | +++ | SSR1 | +++ | --- | PWR | RESET
bPlace: Tape 4 | Tape 1 | Tape 3 | PCB Manufacturers Logo or Mark | Tape 5 | Tape 2